# EAGLE design FM-1.2.1 (EAGLE 8.2.1)
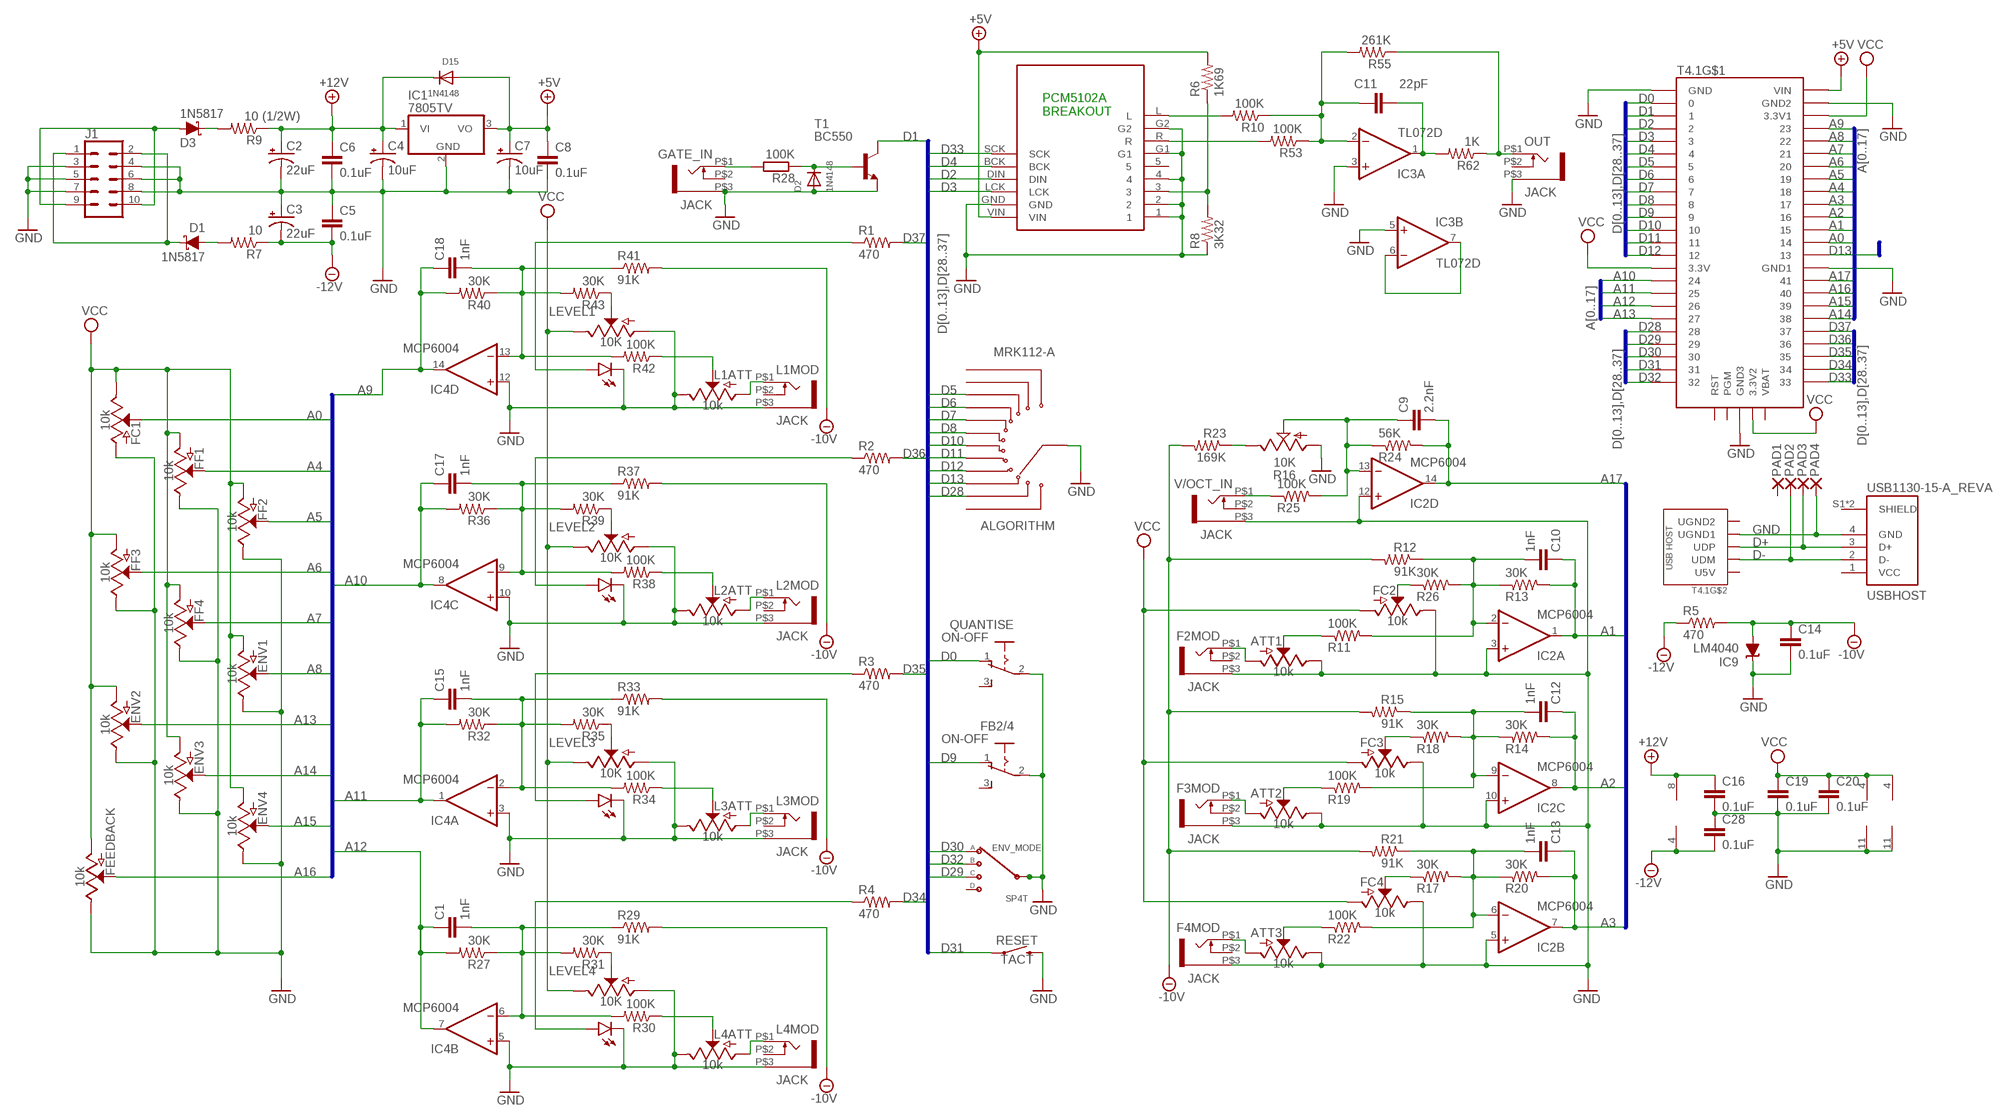
[diagram p0: schematic, sheet 1]

## Parts
ALGORITHM  MRK112-A  [SW_MRK112-A]
ATT1  10k  POTENTIOMETER-PTH-9MM-1/20W-20%  [POT-PTH-ALPS]
ATT2  10k  POTENTIOMETER-PTH-9MM-1/20W-20%  [POT-PTH-ALPS]
ATT3  10k  POTENTIOMETER-PTH-9MM-1/20W-20%  [POT-PTH-ALPS]
C1  1nF  C-EUC0603K  [C0603K]
C2  22uF  10UF-POLAR-RADIAL-2.5MM-25V-20%  [CPOL-RADIAL-2.5MM-5MM]
C3  22uF  10UF-POLAR-RADIAL-2.5MM-25V-20%  [CPOL-RADIAL-2.5MM-5MM]
C4  10uF  10UF-POLAR-RADIAL-2.5MM-25V-20%  [CPOL-RADIAL-2.5MM-5MM]
C5  0.1uF  C-EUC0603K  [C0603K]
C6  0.1uF  C-EUC0603K  [C0603K]
C7  10uF  10UF-POLAR-RADIAL-2.5MM-25V-20%  [CPOL-RADIAL-2.5MM-5MM]
C8  0.1uF  C-EUC0603K  [C0603K]
C9  2.2nF  C-EUC0603K  [C0603K]
C10  1nF  C-EUC0603K  [C0603K]
C11  22pF  C-EUC0603K  [C0603K]
C12  1nF  C-EUC0603K  [C0603K]
C13  1nF  C-EUC0603K  [C0603K]
C14  0.1uF  C-EUC0603K  [C0603K]
C15  1nF  C-EUC0603K  [C0603K]
C16  0.1uF  C-EUC0603K  [C0603K]
C17  1nF  C-EUC0603K  [C0603K]
C18  1nF  C-EUC0603K  [C0603K]
C19  0.1uF  C-EUC0603K  [C0603K]
C20  0.1uF  C-EUC0603K  [C0603K]
C28  0.1uF  C-EUC0603K  [C0603K]
D1  1N5817  DIODE-SCHOTTKY-BAT60A  [SOD-323]
D2  1N4148  DIODESOD-123  [SOD-123]
D3  1N5817  DIODE-SCHOTTKY-BAT60A  [SOD-323]
D15  1N4148  DIODESOD-123  [SOD-123]
ENV1  10k  POTENTIOMETER-PTH-9MM-1/20W-20%  [POT-PTH-ALPS]
ENV2  10k  POTENTIOMETER-PTH-9MM-1/20W-20%  [POT-PTH-ALPS]
ENV3  10k  POTENTIOMETER-PTH-9MM-1/20W-20%  [POT-PTH-ALPS]
ENV4  10k  POTENTIOMETER-PTH-9MM-1/20W-20%  [POT-PTH-ALPS]
ENV_MODE  SP4T  [SP4T]
F2MOD  JACK  WQP-PJ301M-12_JACK  [WQP-PJ301M-12_JACK]
F3MOD  JACK  WQP-PJ301M-12_JACK  [WQP-PJ301M-12_JACK]
F4MOD  JACK  WQP-PJ301M-12_JACK  [WQP-PJ301M-12_JACK]
FB2/4  ON-OFF  255SB  [255SB]
FC1  10k  POTENTIOMETER-PTH-9MM-1/20W-20%  [POT-PTH-ALPS]
FC2  10k  POTENTIOMETER-PTH-9MM-1/20W-20%  [POT-PTH-ALPS]
FC3  10k  POTENTIOMETER-PTH-9MM-1/20W-20%  [POT-PTH-ALPS]
FC4  10k  POTENTIOMETER-PTH-9MM-1/20W-20%  [POT-PTH-ALPS]
FEEDBACK  10k  POTENTIOMETER-PTH-9MM-1/20W-20%  [POT-PTH-ALPS]
FF1  10k  POTENTIOMETER-PTH-9MM-1/20W-20%  [POT-PTH-ALPS]
FF2  10k  POTENTIOMETER-PTH-9MM-1/20W-20%  [POT-PTH-ALPS]
FF3  10k  POTENTIOMETER-PTH-9MM-1/20W-20%  [POT-PTH-ALPS]
FF4  10k  POTENTIOMETER-PTH-9MM-1/20W-20%  [POT-PTH-ALPS]
GATE_IN  JACK  WQP-PJ301M-12_JACK  [WQP-PJ301M-12_JACK]
IC1  7805TV  [TO220V]
IC2  MCP6004  4AMP_P4+11D  [SO14]
IC3  TL072D  [SO08]
IC4  MCP6004  4AMP_P4+11D  [SO14]
IC9  LM4040  LM4041A12LP  [LP_O-PBCY-W3]
J1  CONN_05X2SHD  [2X5-SHROUDED]
L1ATT  10k  POTENTIOMETER-PTH-9MM-1/20W-20%  [POT-PTH-ALPS]
L1MOD  JACK  WQP-PJ301M-12_JACK  [WQP-PJ301M-12_JACK]
L2ATT  10k  POTENTIOMETER-PTH-9MM-1/20W-20%  [POT-PTH-ALPS]
L2MOD  JACK  WQP-PJ301M-12_JACK  [WQP-PJ301M-12_JACK]
L3ATT  10k  POTENTIOMETER-PTH-9MM-1/20W-20%  [POT-PTH-ALPS]
L3MOD  JACK  WQP-PJ301M-12_JACK  [WQP-PJ301M-12_JACK]
L4ATT  10k  POTENTIOMETER-PTH-9MM-1/20W-20%  [POT-PTH-ALPS]
L4MOD  JACK  WQP-PJ301M-12_JACK  [WQP-PJ301M-12_JACK]
LEVEL1  10K  POTENTIOMETER_SLIDE_LEDMEDIUM  [SLIDER-MEDIUM-LED]
LEVEL2  10K  POTENTIOMETER_SLIDE_LEDMEDIUM  [SLIDER-MEDIUM-LED]
LEVEL3  10K  POTENTIOMETER_SLIDE_LEDMEDIUM  [SLIDER-MEDIUM-LED]
LEVEL4  10K  POTENTIOMETER_SLIDE_LEDMEDIUM  [SLIDER-MEDIUM-LED]
OUT  JACK  WQP-PJ301M-12_JACK  [WQP-PJ301M-12_JACK]
PAD1  1,6/0,9  [1,6/0,9]
PAD2  1,6/0,9  [1,6/0,9]
PAD3  1,6/0,9  [1,6/0,9]
PAD4  1,6/0,9  [1,6/0,9]
QUANTISE  ON-OFF  255SB  [255SB]
R1  470  R-US_R0603  [R0603]
R2  470  R-US_R0603  [R0603]
R3  470  R-US_R0603  [R0603]
R4  470  R-US_R0603  [R0603]
R5  470  R-US_R0603  [R0603]
R6  1K69  R-US_R0603  [R0603]
R7  10  R-US_R0603  [R0603]
R8  3K32  R-US_R0603  [R0603]
R9  10 (1/2W)  R-US_0207/10  [0207/10]
R10  100K  R-US_R0603  [R0603]
R11  100K  R-US_R0603  [R0603]
R12  91K  R-US_R0603  [R0603]
R13  30K  R-US_R0603  [R0603]
R14  30K  R-US_R0603  [R0603]
R15  91K  R-US_R0603  [R0603]
R16  10K  TRIM_US-B25P  [B25P]
R17  30K  R-US_R0603  [R0603]
R18  30K  R-US_R0603  [R0603]
R19  100K  R-US_R0603  [R0603]
R20  30K  R-US_R0603  [R0603]
R21  91K  R-US_R0603  [R0603]
R22  100K  R-US_R0603  [R0603]
R23  169K  R-US_R0603  [R0603]
R24  56K  R-US_R0603  [R0603]
R25  100K  R-US_R0603  [R0603]
R26  30K  R-US_R0603  [R0603]
R27  30K  R-US_R0603  [R0603]
R28  100K  R-EU_R0603  [R0603]
R29  91K  R-US_R0603  [R0603]
R30  100K  R-US_R0603  [R0603]
R31  30K  R-US_R0603  [R0603]
R32  30K  R-US_R0603  [R0603]
R33  91K  R-US_R0603  [R0603]
R34  100K  R-US_R0603  [R0603]
R35  30K  R-US_R0603  [R0603]
R36  30K  R-US_R0603  [R0603]
R37  91K  R-US_R0603  [R0603]
R38  100K  R-US_R0603  [R0603]
R39  30K  R-US_R0603  [R0603]
R40  30K  R-US_R0603  [R0603]
R41  91K  R-US_R0603  [R0603]
R42  100K  R-US_R0603  [R0603]
R43  30K  R-US_R0603  [R0603]
R53  100K  R-US_R0603  [R0603]
R55  261K  R-US_R0603  [R0603]
R62  1K  R-US_R0603  [R0603]
RESET  TACT  MOMENTARY-SWITCH-SPST-PTH-6.0MM  [TACTILE_SWITCH_PTH_6.0MM]
T1  BC550  BC547  [TO92]
T4.1  TEENSY4.1  [TEENSY4.1]
U$2  PCM5102A BREAKOUT  I2S_PCM_51XX_SOUNDCARD  [I2S_PCM_5100_SOUNDCARD]
USBHOST  USB1130-15-A_REVA  [GCT_USB1130-15-A_REVA]
V/OCT_IN  JACK  WQP-PJ301M-12_JACK  [WQP-PJ301M-12_JACK]

## Nets
+5V: C7.1(+) C8.1 D15.A IC1.3(VO) R6.2 T4.1.VIN U$2.VIN
+12V: C2.1(+) C4.1(+) C6.1 C16.1 D15.C IC1.1(VI) IC3.8(P:V+) R9.1
-10V: C14.1 IC9.3(A) R5.2 R12.2 R15.2 R21.2 R23.2 R29.2 R33.2 R37.2 R41.2
-12V: C3.2(-) C5.2 C28.2 IC3.4(P:V-) R5.1 R7.1
A0: FC1.P$2(S) T4.1.14/A0
A1: C10.1 IC2.1(A:OUT) R13.2 T4.1.15/A1
A2: C12.1 IC2.8(C:OUT) R14.2 T4.1.16/A2
A3: C13.1 IC2.7(B:OUT) R20.2 T4.1.17/A3
A4: FF1.P$2(S) T4.1.18/A4/SDA
A5: FF2.P$2(S) T4.1.19/A5/SCL
A6: FF3.P$2(S) T4.1.20/A6
A7: FF4.P$2(S) T4.1.21/A7
A8: ENV1.P$2(S) T4.1.22/A8
A9: C18.1 IC4.14(D:OUT) R40.2 T4.1.23/A9
A10: C17.1 IC4.8(C:OUT) R36.2 T4.1.24
A11: C15.1 IC4.1(A:OUT) R32.2 T4.1.25
A12: C1.1 IC4.7(B:OUT) R27.2 T4.1.26
A13: ENV2.P$2(S) T4.1.27
A14: ENV3.P$2(S) T4.1.38
A15: ENV4.P$2(S) T4.1.39
A16: FEEDBACK.P$2(S) T4.1.40
A17: C9.2 IC2.14(D:OUT) R24.2 T4.1.41
D0: QUANTISE.1(O) T4.1.0/RX
D1: T1.3(C) T4.1.1/TX
D2: T4.1.2 U$2.DIN
D3: T4.1.3 U$2.LCK
D4: T4.1.4 U$2.BCK
D5: ALGORITHM.10 T4.1.5
D6: ALGORITHM.9 T4.1.6
D7: ALGORITHM.8 T4.1.7
D8: ALGORITHM.7 T4.1.8
D9: FB2/4.1(O) T4.1.9
D10: ALGORITHM.6 T4.1.10/CS
D11: ALGORITHM.5 T4.1.11/MOSI
D12: ALGORITHM.4 T4.1.12/MISO
D13: ALGORITHM.3 T4.1.13/SCK
D28: ALGORITHM.2 T4.1.28
D29: ENV_MODE.4(C) T4.1.29
D30: ENV_MODE.2(A) T4.1.30
D31: RESET.1 T4.1.31/A12
D32: ENV_MODE.3(B) T4.1.32
D33: T4.1.33 U$2.SCK
D34: R4.2 T4.1.34
D35: R3.2 T4.1.35
D36: R2.2 T4.1.36
D37: R1.2 T4.1.37
D+: PAD3.1(P) T4.1.UD+(UDP) USBHOST.3(D+)
D-: PAD2.1(P) T4.1.UD-(UDM) USBHOST.2(D-)
GND: ALGORITHM.A ATT1.P$1(E) ATT2.P$1(E) ATT3.P$1(E) C2.2(-) C3.1(+) C4.2(-) C5.1 C6.2 C7.2(-) C8.2 C14.2 C16.2 C19.2 C20.2 C28.1 D2.A ENV1.P$1(E) ENV2.P$1(E) ENV3.P$1(E) ENV4.P$1(E) ENV_MODE.1(INPUT) ENV_MODE.6 F2MOD.P$3 F3MOD.P$3 F4MOD.P$3 FB2/4.2(P) FC1.P$3(A) FC2.P$1(E) FC3.P$1(E) FC4.P$1(E) FEEDBACK.P$1(E) FF1.P$1(E) FF2.P$1(E) FF3.P$1(E) FF4.P$1(E) GATE_IN.P$3 IC1.2(GND) IC2.3(A:+IN) IC2.5(B:+IN) IC2.10(C:+IN) IC2.11(P:V-) IC2.12(D:+IN) IC3.3(A:+IN) IC3.5(B:+IN) IC4.3(A:+IN) IC4.5(B:+IN) IC4.10(C:+IN) IC4.11(P:V-) IC4.12(D:+IN) IC9.2(C) J1.3 J1.4 J1.5 J1.6 J1.7 J1.8 L1ATT.P$1(E) L1MOD.P$3 L2ATT.P$1(E) L2MOD.P$3 L3ATT.P$1(E) L3MOD.P$3 L4ATT.P$1(E) L4MOD.P$3 LEVEL1.P$1 LEVEL1.P$E(E) LEVEL2.P$1 LEVEL2.P$E(E) LEVEL3.P$1 LEVEL3.P$E(E) LEVEL4.P$1 LEVEL4.P$E(E) OUT.P$3 PAD4.1(P) QUANTISE.2(P) R8.1 R16.A RESET.3 T1.1(E) T4.1.AGND(GND2) T4.1.GND T4.1.GND1 T4.1.GND2(GND3) T4.1.GND-U1(UGND1) U$2.1 U$2.2 U$2.4 U$2.G1 U$2.G2 U$2.GND USBHOST.4(GND) V/OCT_IN.P$3
N$1: C11.2 IC3.1(A:OUT) R62.2
N$2: LEVEL3.P$B(B) R3.1
N$3: C15.2 IC4.2(A:-IN) R32.1 R33.1 R34.2 R35.2
N$4: D1.C J1.1 J1.2
N$5: R25.1 V/OCT_IN.P$1
N$6: D3.A J1.9 J1.10
N$7: D3.C R9.2
N$8: LEVEL3.P$2 R35.1
N$9: D1.A R7.2
N$10: LEVEL4.P$B(B) R4.1
N$11: R10.2 U$2.L
N$12: R6.1 R8.2 U$2.3
N$13: R53.2 U$2.R
N$14: ATT2.P$3(A) F3MOD.P$1
N$15: FC2.P$2(S) R26.1
N$16: C10.2 IC2.2(A:-IN) R11.2 R12.1 R13.1 R26.2
N$17: C12.2 IC2.9(C:-IN) R14.1 R15.1 R18.2 R19.2
N$18: ATT1.P$2(S) R11.1
N$19: C13.2 IC2.6(B:-IN) R17.2 R20.1 R21.1 R22.2
N$20: ATT2.P$2(S) R19.1
N$21: C9.1 IC2.13(D:-IN) R16.S R24.1 R25.2
N$22: FC4.P$2(S) R17.1
N$23: ATT3.P$3(A) F4MOD.P$1
N$24: FC3.P$2(S) R18.1
N$25: R16.E R23.1
N$26: IC3.6(B:-IN) IC3.7(B:OUT)
N$27: ATT3.P$2(S) R22.1
N$28: ATT1.P$3(A) F2MOD.P$1
N$29: GATE_IN.P$1 R28.2
N$30: D2.C R28.1 T1.2(B)
N$31: C1.2 IC4.6(B:-IN) R27.1 R29.1 R30.2 R31.2
N$32: LEVEL4.P$2 R31.1
N$33: L4ATT.P$3(A) L4MOD.P$1
N$34: L4ATT.P$2(S) R30.1
N$36: L3ATT.P$3(A) L3MOD.P$1
N$37: L3ATT.P$2(S) R34.1
N$39: LEVEL2.P$B(B) R2.1
N$40: C17.2 IC4.9(C:-IN) R36.1 R37.1 R38.2 R39.2
N$41: LEVEL2.P$2 R39.1
N$42: L2ATT.P$3(A) L2MOD.P$1
N$43: L2ATT.P$2(S) R38.1
N$45: LEVEL1.P$B(B) R1.1
N$46: C18.2 IC4.13(D:-IN) R40.1 R41.1 R42.2 R43.2
N$47: LEVEL1.P$2 R43.1
N$48: L1ATT.P$3(A) L1MOD.P$1
N$49: L1ATT.P$2(S) R42.1
N$53: C11.1 IC3.2(A:-IN) R10.1 R53.1 R55.2
N$55: OUT.P$1 R55.1 R62.1
VCC: C19.1 C20.1 ENV1.P$3(A) ENV2.P$3(A) ENV3.P$3(A) ENV4.P$3(A) FC1.P$1(E) FC2.P$3(A) FC3.P$3(A) FC4.P$3(A) FEEDBACK.P$3(A) FF1.P$3(A) FF2.P$3(A) FF3.P$3(A) FF4.P$3(A) IC2.4(P:V+) IC4.4(P:V+) LEVEL1.P$3 LEVEL2.P$3 LEVEL3.P$3 LEVEL4.P$3 T4.1.3V3(3.3V) T4.1.3V3_LO(3.3V1) T4.1.V33(3.3V2)
Unconnected: ALGORITHM.1 ALGORITHM.11 ALGORITHM.12 ENV_MODE.5(D) F2MOD.P$2 F3MOD.P$2 F4MOD.P$2 FB2/4.3(S) GATE_IN.P$2 L1MOD.P$2 L2MOD.P$2 L3MOD.P$2 L4MOD.P$2 OUT.P$2 PAD1.1(P) QUANTISE.3(S) T4.1.ELED T4.1.ER+ T4.1.ER- T4.1.ET+(ET-) T4.1.ET-(ET+) T4.1.GND-E(EGND) T4.1.GND-U2(UGND2) T4.1.PROG(PGM) T4.1.RST T4.1.UVHST(U5V) T4.1.VBAT U$2.5 USBHOST.S1(SHIELD) USBHOST.S2(SHIELD) V/OCT_IN.P$2

## Buses
A[0..17]
D[0..13],D[28..37]

## Notes on the sheet
- PCM5102A
  BREAKOUT

## Power pins joined to a net without a drawn wire
VCC: USBHOST.1(VCC)

## Library data of the parts
ALGORITHM = MRK112-A:MRK112-A: Check availability <https://pricing.snapeda.com/parts/MRK112-A/NKK%20Switches/view-part?ref=eda>; AVAILABILITY: In Stock; DESCRIPTION: Rotary Switch 2 ~ 12 Position SP12T 0.4VA (AC/DC) 28 VAC Panel Mount, Through Hole; MF: NKK Switches; MP: MRK112-A; PACKAGE: None; PRICE: None; PURCHASE-URL: https://pricing.snapeda.com/search/part/MRK112-A/?ref=eda
ATT1-ATT3 ENV1-ENV4 FC1-FC4 FEEDBACK FF1-FF4 L1ATT L2ATT L3ATT L4ATT = SparkFun-Resistors:POTENTIOMETER: Potentiometer (Pot) Three-terminal potentiometers, with an adjustable wiper and two adjustable resistors. A pot can be used to create a configurable voltage divider, or as a variable resistor. Variants ALPS_POT and ALPS_POT_KIT - PTH, breadboard compatible, 9mm square pots Rotary Potentiometer - Linear (10k ohm) <https://www.sparkfun.com/products/9288> (COM-09288) The KIT variant exposes copper on only one side of the PTH pad, so the part can only be assembled on one side of the PCB. Useful for beginner soldering kits.; PROD_ID: RES-09177; SF_SKU: COM-09288
C1 C5 C6 C8-C20 C28 = rcl:C-EU: CAPACITOR, European symbol
C2 C3 = SparkFun-Capacitors:10UF-POLAR: 10.0µF polarized capacitors A capacitor is a passive two-terminal electrical component used to store electrical energy temporarily in an electric field.; PROD_ID: CAP-08440; VALUE: 10uF
C4 C7 = SparkFun-Capacitors:10UF-POLAR: 10.0µF polarized capacitors A capacitor is a passive two-terminal electrical component used to store electrical energy temporarily in an electric field.; PROD_ID: CAP-08440
D1 D3 = SparkFun-DiscreteSemi:DIODE-SCHOTTKY: Schottky diode A Schottky diode is a semiconductor diode which has a low forward voltage drop and a very fast switching action.; PROD_ID: DIO-14072; VALUE: 3A/10V/280mV
D2 D15 = adafruit:DIODE: Diode SMADIODE - SMA Surface Mount Package 20V 1A Schottky Diode Digikey: 641-1014-6-ND DO-1N4148 - Through Hole Small Current Diode SOD-123 20V 1 A (.5mV Vf) Schottky Diode - Digikey: MBRX120TPMSCT-ND SOD-323 10V 570mA (.38mV Vf, 3ns) Schottky Diode - Digikey: ZLLS410CT-ND SOD-523 30V 30mA Schottky Diode (RB751S-40TE61) - Digikey: RB751S-40TE61CT-ND SOT23-R/W - SOT23 Package (R = Solder Paste/Reflow Ovens, W = Hand-Soldering) BAT54Film 40V 300mA - Digikey: 497-7162-1-ND
ENV_MODE = switches-2:SP4T
F2MOD F3MOD F4MOD GATE_IN L1MOD L2MOD L3MOD L4MOD OUT V/OCT_IN = thonkiconn:WQP-PJ301M-12_JACK
FB2/4 QUANTISE = customswitch:255SB: SLIDING SWITCH Distributor Buerklin, 11G810
IC1 = linear:78*: Positive VOLTAGE REGULATOR Source: http://cache.national.com/ds/LM/LM78L05.pdf http://www.fairchildsemi.com/ds/LM/LM7805.pdf
IC2 IC4 = linear:4AMP_P4+11: OP AMP
IC3 = linear:TL072: OP AMP
IC9 = texas:LM4041: PRECISION MICROPOWER SHUNT VOLTAGE REFERENCE Source: http://focus.ti.com/lit/ds/slcs146e/slcs146e.pdf; OC_FARNELL: 9486119; OC_NEWARK: unknown
J1 = SparkFun-Connectors:CONN_05X2: Multi connection point. Often used as Generic Header-pin footprint for 0.1 inch spaced/style header connections For AVR SPI programming port, see special device with nice symbol: "AVR_SPI_PROG_5x2.dev" You can populate with any combo of single row headers, but if you'd like an exact match, check these: 2x5 AVR ICSP Male Header <https://www.sparkfun.com/products/778> (PRT-00778) 2x5 Pin Shrouded Header <https://www.sparkfun.com/products/8506> (PRT-08506) On any of the 0.1 inch spaced packages, you can populate with these: Break Away Headers - Straight <https://www.sparkfun.com/products/116> (PRT-00116) Break Away Male Headers - Right Angle <https://www.sparkfun.com/products/553> (PRT-00553) Female Headers <https://www.sparkfun.com/products/115> (PRT-00115) Break Away Headers - Machine Pin <https://www.sparkfun.com/products/117> (PRT-00117) Break Away Female Headers - Swiss Machine Pin <https://www.sparkfun.com/products/743> (PRT-00743) Special note: the shrouded connector mates well with our 5x2 ribbon cables: 2x5 Pin IDC Ribbon Cable <https://www.sparkfun.com/products/8535> (PRT-08535); PROD_ID: CONN-08671; SF_ID: PRT-08506
LEVEL1-LEVEL4 = SparkFun-Resistors:POTENTIOMETER_SLIDE_LED: Slide Potentiometer Slide-type potentiometers - pots that are adjusted by sliding a wiper up or down. Commonly found en-masse on sound boards. Variants 60MM - Slide Pot - X-Large (10k Linear Taper) <https://www.sparkfun.com/products/9119> (COM-09119) 10k linear slide pot with 60mm travel. Datasheet <http://cdn.sparkfun.com/datasheets/Components/Switches/SC608N-b10k.pdf> 30MM, 30MM-KIT - Slide Pot - Medium (10k Linear Taper) <https://www.sparkfun.com/products/11621> (COM-11621) 10k linear slide pot with 30mm travel. Datasheet <http://cdn.sparkfun.com/datasheets/Components/Switches/C-31-.pdf> (C3031N-1A2-B10K-GP) "KIT" variant, intended for soldering kits, has tStop removed from pads so the component can only be stuffed on one side of the board. 20MM - Slide Pot - Small (10k Linear Taper) <https://www.sparkfun.com/products/11620> (COM-11620) 10k linear slide pot with 20mm travel. Datasheet <http://cdn.sparkfun.com/datasheets/Components/Switches/C-31-.pdf> (C2031N-1A2-B10K-GP)
PAD1-PAD4 = wirepad:1,6/0,9: THROUGH-HOLE PAD
R1-R15 R17-R27 R29-R43 R53 R55 R62 = rcl:R-US_: RESISTOR, American symbol
R16 = pot:TRIM_US-: POTENTIOMETER
R28 = resistor:R-EU_: RESISTOR, European symbol
RESET = SparkFun-Switches:MOMENTARY-SWITCH-SPST: Momentary Switch (Pushbutton) - SPST Normally-open (NO) SPST momentary switches (buttons, pushbuttons). Variants PTH-12MM - 12mm square, through-hole Momentary Pushbutton Switch - 12mm Square <https://www.sparkfun.com/products/9190> (COM-09190) PTH-6.0MM, PTH-6.0MM-KIT - 6.0mm square, through-hole Mini Pushbutton Switch <https://www.sparkfun.com/products/97> (COM-00097) KIT package intended for soldering kit's - only one side of pads' copper is exposed. PTH-RIGHT-ANGLE-KIT - Right-angle, through-hole Right Angle Tactile Button <https://www.sparkfun.com/products/10791> - Used on SparkFun BigTime Watch Kit <https://www.sparkfun.com/products/11734> SMD-12MM - 12mm square, surface-mount Tactile Button - SMD (12mm) <https://www.sparkfun.com/products/12993> (COM-12993) Used on SparkFun PicoBoard <https://www.sparkfun.com/products/11888> SMD-4.5MM - 4.5mm Square Trackball Switch Used on SparkFun Blackberry Trackballer Breakout <https://www.sparkfun.com/products/13169> SMD-4.6MMX2.8MM - 4.60mm x 2.80mm, surface mount Used on SparkFun Pro Micro - RP2040 <https://www.sparkfun.com/products/17717> SMD-5.2MM, SMD-5.2-REDUNDANT - 5.2mm square, surface-mount Mini Pushbutton Switch - SMD <https://www.sparkfun.com/products/8720> (COM-08720) Used on Arduino Pro Mini <https://www.sparkfun.com/products/11114> REDUNDANT package connects both switch circuits together SMD-6.0X3.5MM - 6.0 x 3.5mm, surface mount Momentary Reset Switch SMD <https://www.sparkfun.com/products/8229> (COM-08229) SMD-6.2MM-TALL - 6.2mm square, surface mount Tactile Button - SMD (6mm) <https://www.sparkfun.com/products/12992> Used on SparkFun Digital Sandbox <https://www.sparkfun.com/products/12651> SMD-RIGHT-ANGLE - Right-angle, surface mount Used on SparkFun Block for Intel® Edison - Arduino <https://www.sparkfun.com/products/13036>; PROD_ID: SWCH-08441; SF_SKU: COM-00097
T1 = transistor:BC547: NPN TRANSISTOR
T4.1 = teensy4.1.dist:TEENSY4.1
U$2 = PCM5102A:I2S_PCM_51XX_SOUNDCARD
USBHOST = USB1130-15-A_REVA:USB1130-15-A_REVA: Check availability <https://pricing.snapeda.com/parts/USB1130-15-A/Global%20Connector%20Technology/view-part?ref=eda>; AVAILABILITY: In Stock; DESCRIPTION: USB 2.0 Connector Full size Horizontal Plug, type A, 4 Pins, Through hole, Top mount, 6.99mm profile, High mating cycle, charging receptacle; MF: Global Connector Technology; MP: USB1130-15-A; PACKAGE: None; PRICE: None; PURCHASE-URL: https://pricing.snapeda.com/search/part/USB1130-15-A/?ref=eda

## Board
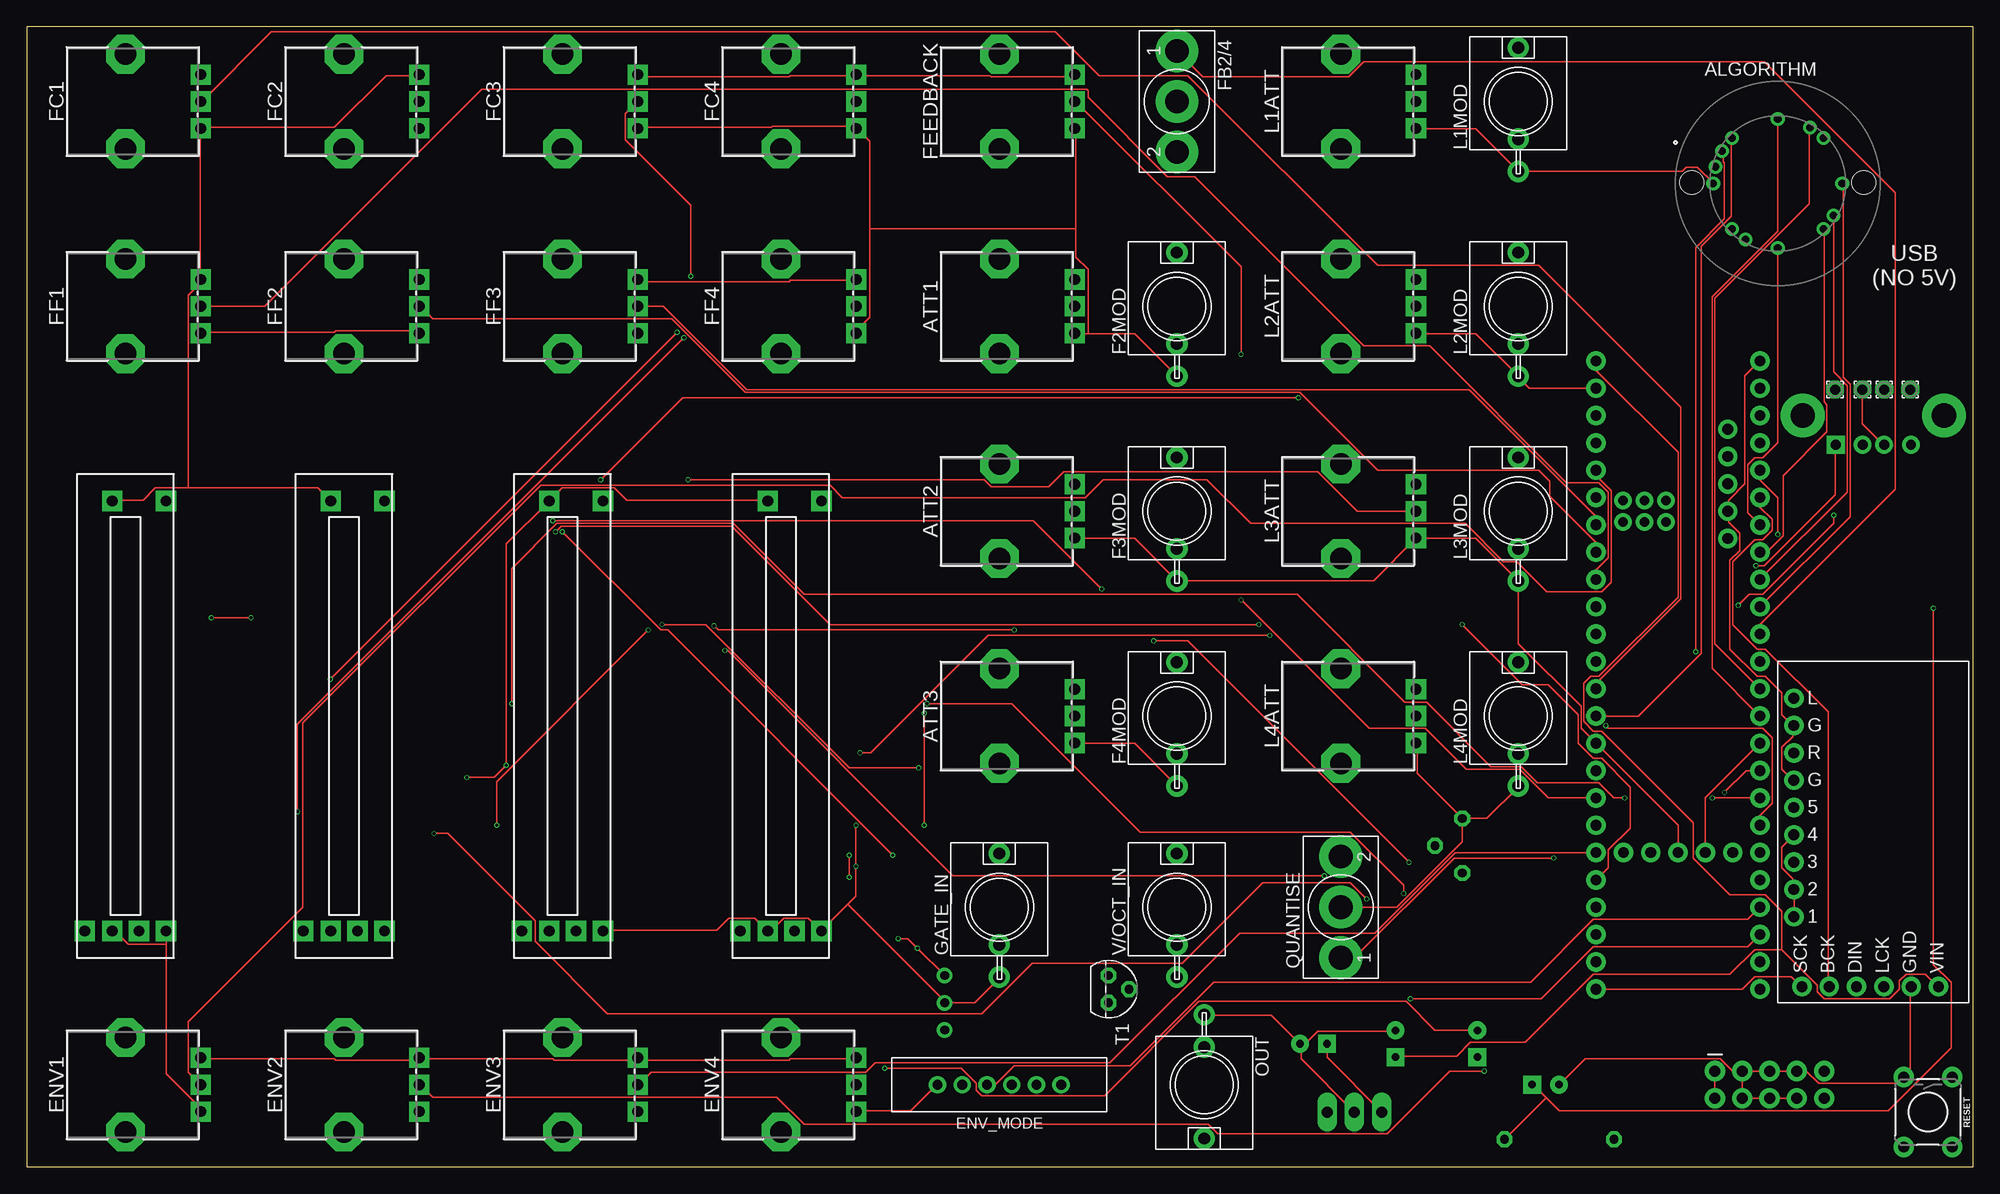
[diagram p1: board, top side]
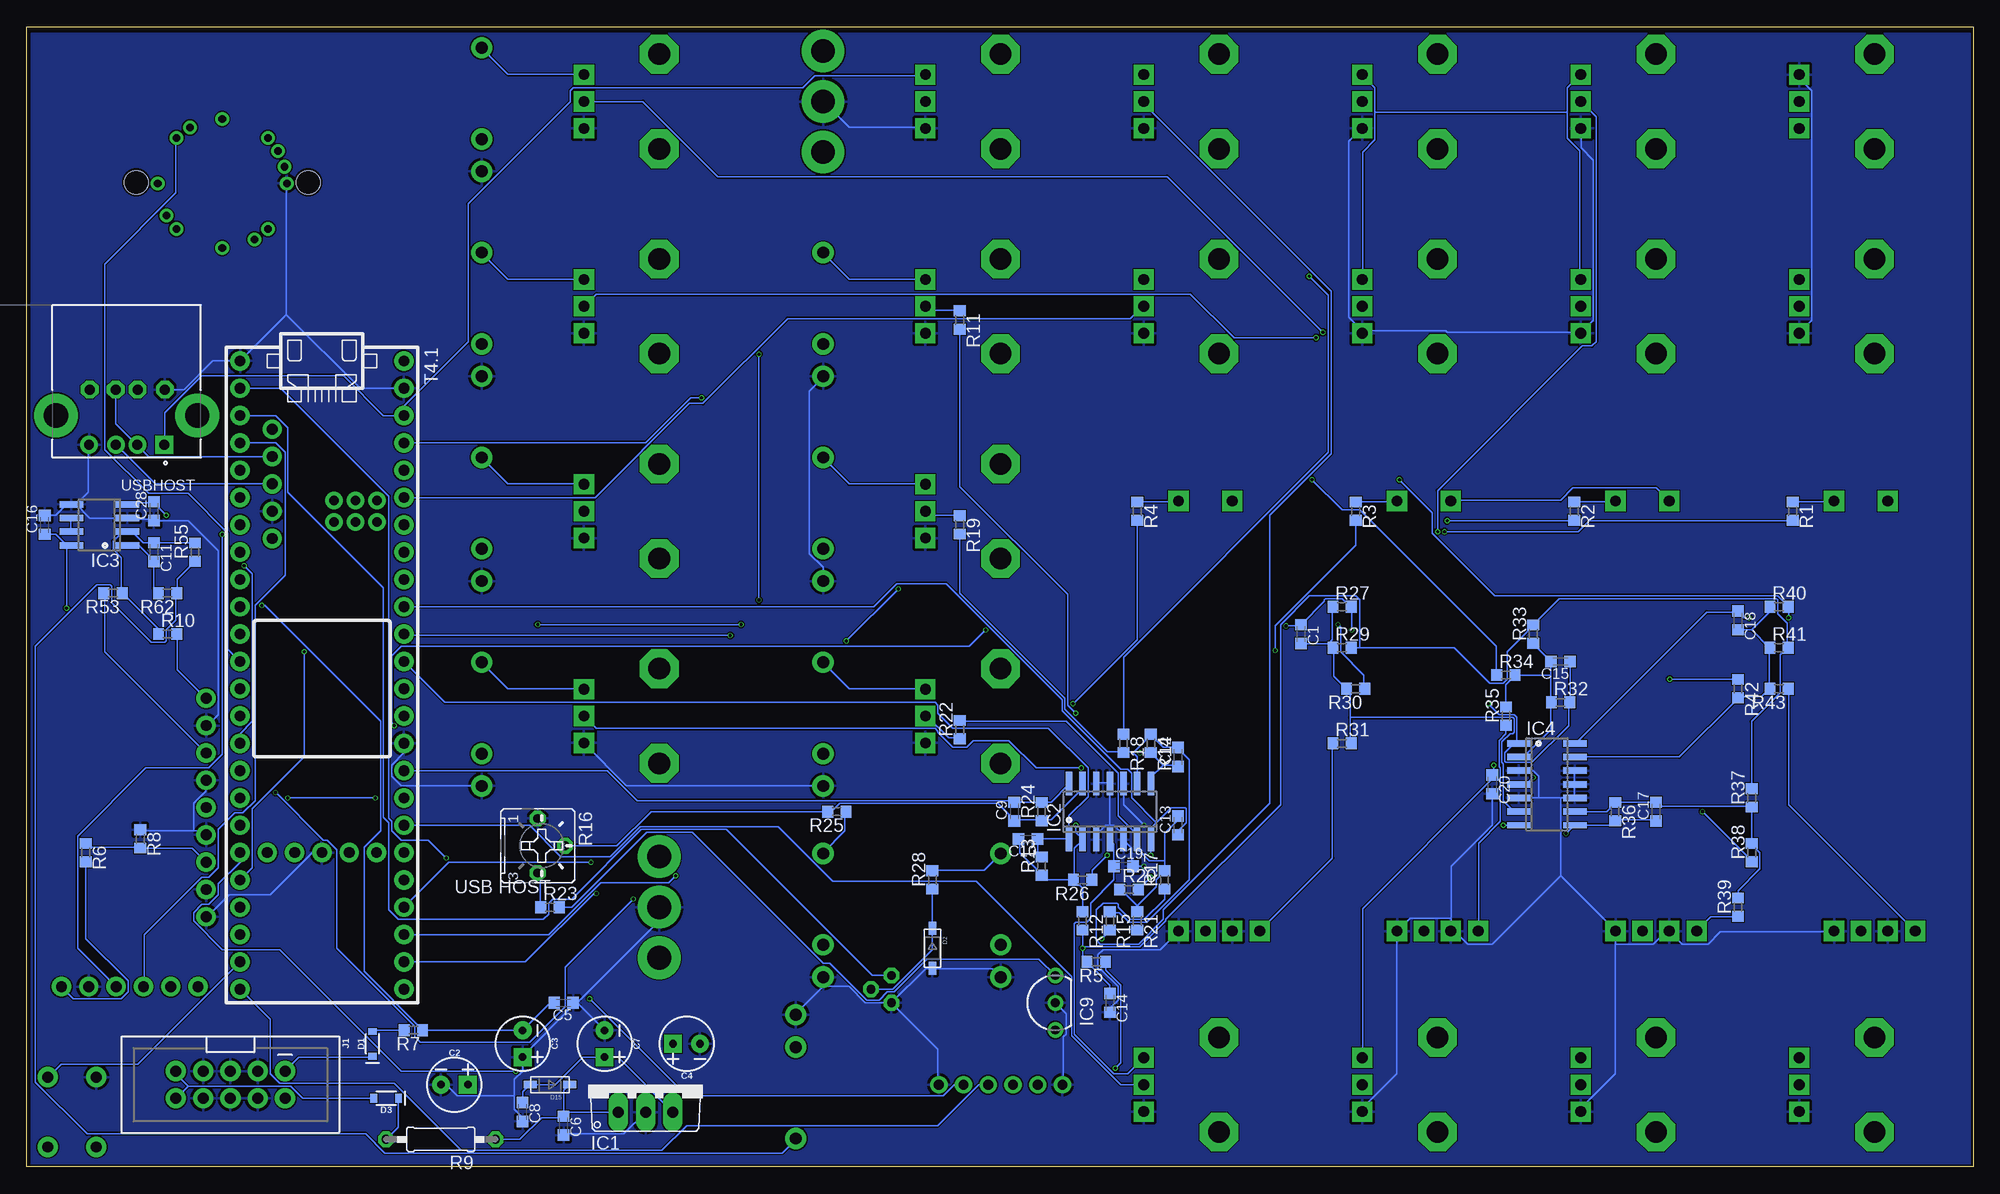
[diagram p2: board, bottom side, seen from below]

Size 181 x 106 mm. Coordinates in mm from the lower left corner, seen from the top.
Outline: 0,0 181,0 181,106 0,106 0,0
Copper layers (1*16): Top 0.035mm / dielectric 1.6mm / Bottom 0.035mm
Design rules "jlcpcb-2layers": minimum track width 5mil, minimum drill 0.3mm, track to track 5mil, track to pad 5mil, pad to pad 5mil, via to via 5mil, smd to smd 5mil, copper to edge 0.2mm, drill to drill 6mil, minimum pad ring 10mil, minimum via ring 3mil, stop-mask expansion 4mil, vias tented up to drill 0mil, thermal gap 10mil
Holes 2.2 mm at 154.83,91.53 170.83,91.53

### Footprints (pad centres in the part's own frame; a part is rotated, then mirrored left to right if it is on the bottom)
SW_MRK112-A = drill 0.7 pad 1: 1 -1.553,-5.796; 2 -3,-5.196; 3 -4.243,-4.243; 4 -6,0; 5 -5.196,3; 6 -4.243,4.243; 7 0,6; 8 3,5.196; 9 4.243,4.243; 10 6,0; 11 5.196,-3; 12 4.243,-4.243; A 0,-6
POT-PTH-ALPS = drill 1 pad 1.88 square: P$1 7,-2.5; P$2 7,0; P$3 7,2.5 | drill 2 octagon: P$4 0,-4.4; P$5 0,4.4
C0603K = smd 1.05 x 1.08: 1 -0.875,0; 2 0.875,0
CPOL-RADIAL-2.5MM-5MM = drill 0.7 pad 1.651 square: 1 1.25,0 | drill 0.7 pad 1.651: 2 -1.25,0
SOD-323 = smd 0.63 x 0.83: A 1.15,0; C -1.15,0
SOD-123 = smd 1.2 x 0.7: A 1.85,0; C -1.85,0
SP4T = drill 0.9: 1 -5.75,0; 2 -3.45,0; 3 -1.15,0; 4 1.15,0; 5 3.45,0; 6 5.75,0
WQP-PJ301M-12_JACK = drill 1.1: P$1 0,5; P$2 0,-3.5; P$3 0,-6.5
255SB = drill 2.2: 1 -4.7,0; 2 0,0; 3 4.7,0
TO220V = drill 1.016 long: 1 -2.54,-2.54; 2 0,-2.54; 3 2.54,-2.54
SO14 = smd 0.6 x 2.2: 1 -3.81,-2.6; 2 -2.54,-2.6; 3 -1.27,-2.6; 4 0,-2.6; 5 1.27,-2.6; 6 2.54,-2.6; 7 3.81,-2.6; 8 3.81,2.6; 9 2.54,2.6; 10 1.27,2.6; 11 0,2.6; 12 -1.27,2.6; 13 -2.54,2.6; 14 -3.81,2.6
SO08 = smd 0.6 x 2.2: 1 -1.905,-2.6; 2 -0.635,-2.6; 3 0.635,-2.6; 4 1.905,-2.6; 5 1.905,2.6; 6 0.635,2.6; 7 -0.635,2.6; 8 -1.905,2.6
LP_O-PBCY-W3 = drill 0.8 pad 1.4: 1 -2.54,0; 2 0,0; 3 2.54,0
2X5-SHROUDED = drill 1.016 pad 1.88: 1 -1.27,5.08; 2 1.27,5.08; 3 -1.27,2.54; 4 1.27,2.54; 5 -1.27,0; 6 1.27,0; 7 -1.27,-2.54; 8 1.27,-2.54; 9 -1.27,-5.08; 10 1.27,-5.08
SLIDER-MEDIUM-LED = drill 1 pad 1.88 square: P$1 -20,1.23; P$2 -20,3.77; P$3 20,1.23; P$B 20,-3.77; P$E -20,-3.77; P$L -20,-1.27
1,6/0,9 = drill 0.914 pad 1.6 octagon: 1 0,0
R0603 = smd 1 x 1.1: 1 -0.85,0; 2 0.85,0
0207/10 = drill 0.813 octagon: 1 -5.08,0; 2 5.08,0
B25P = drill 0.813 octagon: A -2.54,0; E 2.54,0; S 0,2.54
TACTILE_SWITCH_PTH_6.0MM = drill 1.016 pad 1.88: 1 -3.251,2.261; 2 3.251,2.261; 3 -3.251,-2.261; 4 3.251,-2.261
TO92 = drill 0.813 octagon: 1 1.27,0; 2 0,1.905; 3 -1.27,0
TEENSY4.1 = drill 1: 0/RX -26.67,-7.62; 1/TX -24.13,-7.62; 2 -21.59,-7.62; 3 -19.05,-7.62; 3V3 6.35,-7.62; 3V3_LO -24.13,7.62; 4 -16.51,-7.62; 5 -13.97,-7.62; 6 -11.43,-7.62; 7 -8.89,-7.62; 8 -6.35,-7.62; 9 -3.81,-7.62; 10/CS -1.27,-7.62; 11/MOSI 1.27,-7.62; 12/MISO 3.81,-7.62; 13/SCK 3.81,7.62; 14/A0 1.27,7.62; 15/A1 -1.27,7.62; 16/A2 -3.81,7.62; 17/A3 -6.35,7.62; 18/A4/SDA -8.89,7.62; 19/A5/SCL -11.43,7.62; 20/A6 -13.97,7.62; 21/A7 -16.51,7.62; 22/A8 -19.05,7.62; 23/A9 -21.59,7.62; 24 8.89,-7.62; 25 11.43,-7.62; 26 13.97,-7.62; 27 16.51,-7.62; 28 19.05,-7.62; 29 21.59,-7.62; 30 24.13,-7.62; 31/A12 26.67,-7.62; 32 29.21,-7.62; 33 29.21,7.62; 34 26.67,7.62; 35 24.13,7.62; 36 21.59,7.62; 37 19.05,7.62; 38 16.51,7.62; 39 13.97,7.62; 40 11.43,7.62; 41 8.89,7.62; AGND -26.67,7.62; GND -29.21,-7.62; GND1 6.35,7.62; GND2 16.51,0; GND-U1 -15.24,-4.62; GND-U2 -12.7,-4.62; PROG 16.51,2.54; RST 16.51,5.08; UD+ -17.78,-4.62; UD- -20.32,-4.62; UVHST -22.86,-4.62; V33 16.51,-2.54; VBAT 16.51,-5.08; VIN -29.21,7.62 | drill 0.9: ELED -16.24,3.12; ER+ -16.24,5.12; ER- -14.24,5.12; ET+ -14.24,1.12; ET- -16.24,1.12; GND-E -14.24,3.12
I2S_PCM_5100_SOUNDCARD = drill 1 pad 1.676: 1 1.5,8; 2 1.5,10.54; 3 1.5,13.08; 4 1.5,15.62; 5 1.5,18.16; BCK 4.79,1.5; DIN 7.33,1.5; G1 1.5,20.7; G2 1.5,25.78; GND 12.41,1.5; L 1.5,28.32; LCK 9.87,1.5; R 1.5,23.24; SCK 2.25,1.5; VIN 14.95,1.5
GCT_USB1130-15-A_REVA = drill 0.92 square: 1 -3.5,2.71 | drill 0.92: 2 -1,2.71; 3 1,2.71; 4 3.5,2.71 | drill 2.26: S1 -6.57,0; S2 6.57,0

### Placement (x,y rotation side)
ALGORITHM  162.83,91.44 270 top
ATT1  90.44,80.01 0 top
ATT2  90.44,60.96 0 top
ATT3  90.44,41.91 0 top
C1  62.5,49.53 270 bottom
C2  141.24,7.62 0 bottom
C3  134.89,11.43 270 bottom
C4  119.65,11.43 180 bottom
C5  131.08,15.24 180 bottom
C6  131.08,3.81 270 bottom
C7  127.27,11.43 270 bottom
C8  134.89,5.08 270 bottom
C9  89.17,33.02 90 bottom
C10  87.9,30.48 180 bottom
C11  169.18,57.15 270 bottom
C12  73.93,38.1 90 bottom
C13  73.93,31.75 90 bottom
C14  80.28,15.24 270 bottom
C15  38.37,46.99 180 bottom
C16  179.34,59.69 90 bottom
C17  29.48,33.02 90 bottom
C18  21.86,50.8 270 bottom
C19  79.01,27.94 0 bottom
C20  44.72,35.56 270 bottom
C28  169.18,60.96 90 bottom
D1  148.86,11.43 90 bottom
D2  96.79,20.32 270 bottom
D3  147.59,6.35 180 bottom
D15  132.35,7.62 180 bottom
ENV1  9.16,7.62 0 top
ENV2  29.48,7.62 0 top
ENV3  49.8,7.62 0 top
ENV4  70.12,7.62 0 top
ENV_MODE  90.44,7.62 180 top
F2MOD  106.95,80.01 0 top
F3MOD  106.95,60.96 0 top
F4MOD  106.95,41.91 0 top
FB2/4  106.95,99.06 270 top
FC1  9.16,99.06 0 top
FC2  29.48,99.06 0 top
FC3  49.8,99.06 0 top
FC4  70.12,99.06 0 top
FEEDBACK  90.44,99.06 0 top
FF1  9.16,80.01 0 top
FF2  29.48,80.01 0 top
FF3  49.8,80.01 0 top
FF4  70.12,80.01 0 top
GATE_IN  90.44,24.13 0 top
IC1  123.46,7.62 0 bottom
IC2  80.28,33.02 0 bottom
IC3  174.26,59.69 90 bottom
IC4  39.64,35.56 270 bottom
IC9  85.36,15.24 90 bottom
J1  162.07,7.62 270 bottom
L1ATT  122.19,99.06 0 top
L1MOD  138.7,99.06 0 top
L2ATT  122.19,80.01 0 top
L2MOD  138.7,80.01 0 top
L3ATT  122.19,60.96 0 top
L3MOD  138.7,60.96 0 top
L4ATT  122.19,41.91 0 top
L4MOD  138.7,41.91 0 top
LEVEL1  9.16,41.91 90 top
LEVEL2  29.48,41.91 90 top
LEVEL3  49.8,41.91 90 top
LEVEL4  70.12,41.91 90 top
OUT  109.49,7.62 180 top
PAD1  175.15,72.26 0 top
PAD2  172.74,72.26 0 top
PAD3  170.7,72.26 0 top
PAD4  168.16,72.26 0 top
QUANTISE  122.19,24.13 90 top
R1  16.78,60.96 270 bottom
R2  37.1,60.96 270 bottom
R3  57.42,60.96 270 bottom
R4  77.74,60.96 270 bottom
R5  81.55,19.05 180 bottom
R6  175.53,29.21 270 bottom
R7  145.05,12.7 180 bottom
R8  170.45,30.48 270 bottom
R9  142.51,2.54 180 bottom
R10  167.91,49.53 0 bottom
R11  94.25,78.74 270 bottom
R12  82.82,22.86 270 bottom
R13  86.63,27.94 90 bottom
R14  76.47,39.37 270 bottom
R15  80.28,22.86 270 bottom
R16  133.49,29.84 270 bottom
R17  75.2,26.67 90 bottom
R18  79.01,39.37 270 bottom
R19  94.25,59.69 270 bottom
R20  78.5,25.78 0 bottom
R21  77.74,22.86 270 bottom
R22  94.25,40.64 90 bottom
R23  132.35,24.13 0 bottom
R24  86.63,33.02 90 bottom
R25  105.68,33.02 180 bottom
R26  82.82,26.67 180 bottom
R27  58.69,52.07 0 bottom
R28  96.79,26.67 90 bottom
R29  58.69,48.26 0 bottom
R30  57.42,44.45 180 bottom
R31  58.69,39.37 0 bottom
R32  38.37,43.18 0 bottom
R33  40.91,49.53 90 bottom
R34  43.45,45.72 0 bottom
R35  43.45,41.91 90 bottom
R36  33.29,33.02 270 bottom
R37  20.59,34.29 90 bottom
R38  20.59,29.21 90 bottom
R39  21.86,24.13 90 bottom
R40  18.05,52.07 0 bottom
R41  18.05,48.26 0 bottom
R42  21.86,44.45 270 bottom
R43  18.05,44.45 180 bottom
R53  172.99,53.34 180 bottom
R55  165.37,57.15 90 bottom
R62  167.91,53.34 180 bottom
RESET  176.8,5.08 270 top
T1  100.6,16.51 270 top
T4.1  153.56,45.72 270 bottom
U$2  162.83,15.24 0 top
USBHOST  171.72,69.85 180 bottom
V/OCT_IN  106.95,24.13 0 top

### Tracks (layer width: path | path; a pad name or v marks a point on that pad's centre or on a via)
+5V
  Top 0.127: T4.1.VIN 145.94,74.04 153.56,66.42 153.56,52.96 146.19,45.59 145.43,45.59 144.8,44.96 144.8,41.4 145.69,40.51 146.45,40.51 154.96,32 154.96,28.7 158.38,25.27 161.69,25.27 163.21,23.75 163.21,20.19 | 163.21,20.19 166.51,16.89 166.51,16.26 167.15,15.62 173.24,15.62 174.13,16.51 174.13,17.27 174.77,17.91 176.55,17.91 177.69,16.76 U$2.VIN | 163.21,20.19 160.67,20.19 158.38,17.91 145.69,17.91 139.34,11.56 134.25,11.56 132.99,10.29 127.27,10.29 C7.1
  Bottom 0.127: C8.1 134.89,6.99 134.25,7.62 D15.A 131.84,7.62 129.3,10.16 127.27,10.16 | IC1.3 126,10.16 127.27,10.16 | 127.27,10.16 C7.1 | R6.2 175.53,21.21 171.59,17.27 171.59,16.26 172.23,15.62 176.67,15.62 177.69,16.64 U$2.VIN
+12V  (via drill 0.3)
  Top 0.127: IC1.1 120.92,10.16 120.92,11.43 C4.1 | v177.31,51.94 177.31,18.8 178.96,17.14 178.96,11.05 173.12,5.21 142.51,5.21 141.24,6.48 | 141.24,6.48 140.1,7.62 C2.1 | R9.1 141.24,6.35 141.24,6.48
  Bottom 0.127: 131.08,5.08 131.08,7.11 130.57,7.62 D15.C | IC1.1 131.08,5.08 | 131.08,5.08 C6.1 131.08,4.57 133.11,4.57 135.14,2.54 R9.1 | 177.31,57.78 178.32,58.8 C16.1 | 177.31,57.78 IC3.8 176.93,57.78 | v177.31,51.94 177.31,57.78
-10V  (via drill 0.3)
  Top 0.127: v81.04,21.21 81.93,21.21 v82.82,20.32 IC9.3
  Bottom 0.127: R37.2 20.59,41.4 17.92,44.07 17.92,47.62 17.29,48.26 | 57.04,48.26 48.28,48.26 44.97,44.96 43.7,44.96 43.32,45.34 43.32,47.88 40.91,50.29 R33.2 40.91,50.42 38.5,52.83 18.3,52.83 18.18,52.7 18.18,51.44 17.29,50.55 17.29,48.26 | 57.04,48.26 R29.2 | 17.29,48.26 R41.2 | C14.1 80.28,16.89 82.44,19.05 | 82.82,20.45 R12.2 | 82.44,19.05 82.82,19.43 v82.82,20.32 82.82,20.45 | 82.44,19.05 R5.2 | R21.2 77.74,22.1 80.28,22.1 R15.2 80.28,21.97 v81.04,21.21 | R23.2 130.32,24.13 123.33,31.11 119.14,31.11 106.95,18.92 106.31,18.92 102.89,15.49 101.74,15.49 100.98,16.26 100.35,16.26 97.3,19.3 86.88,19.3 IC9.3 | 57.04,48.26 57.04,52.7 57.42,53.09 61.74,53.09 64.41,50.42 64.41,33.66 75.07,22.99 75.07,22.86 77.49,20.45 82.82,20.45
-12V  (via drill 0.3)
  Top 0.127: v79.77,9.14 86.88,9.14 88.28,7.75 88.28,7.11 88.79,6.6 100.22,6.6 108.98,15.37 128.29,15.37 130.95,12.7 134.89,12.7 C3.2 | v168.04,60.58 168.04,59.82 161.43,53.21 160.16,53.21 v159.15,52.2
  Bottom 0.127: 169.18,61.72 171.47,61.72 171.59,61.59 IC3.4 | C5.2 132.35,15.24 134.89,12.7 | v79.77,9.14 79.26,9.65 79.26,16.89 80.66,18.29 80.66,19.05 R5.1 | 134.89,12.7 144.16,12.7 | 134.89,12.7 C3.2 | v168.04,60.58 169.18,61.72 | v159.15,52.2 158.89,52.2 148.1,41.4 148.1,31.24 149.62,29.72 149.62,18.16 144.16,12.7 | 169.18,61.72 C28.2 | 144.16,12.7 R7.1
A0
  Top 0.127: T4.1.14/A0 145.94,44.96 153.81,52.83 153.81,70.61 140.6,83.82 125.62,83.82 107.97,101.47 99.71,101.47 95.65,105.54 22.75,105.54 16.27,99.06 FC1.P$2
A1
  Bottom 0.127: 87.01,30.48 87.01,29.21 86.63,28.83 R13.2 | 84.09,30.48 87.01,30.48 | 87.01,30.48 C10.1 | 84.09,30.48 84.09,32.64 82.31,34.42 82.31,37.08 86,40.77 94.89,40.77 96.28,42.16 96.28,42.93 96.54,43.18 142.13,43.18 T4.1.15/A1 | 84.09,30.48 IC2.1
A2  (via drill 0.3)
  Top 0.127: v77.49,38.48 78.5,38.48 89.42,49.4 v115.59,49.4
  Bottom 0.127: 75.33,37.34 73.93,37.34 C12.1 | 76.47,38.48 75.33,37.34 | IC2.8 76.47,36.2 75.33,37.34 | v77.49,38.48 76.47,38.48 | v115.59,49.4 145.81,49.4 T4.1.16/A2 | 76.47,38.48 R14.2
A3  (via drill 0.3)
  Top 0.127: v76.47,28.96 v76.47,26.92
  Bottom 0.127: C13.1 73.93,31.24 73.17,32 73.17,33.27 73.3,33.4 74.56,33.4 75.96,32 | 75.96,32 76.47,31.5 IC2.7 v76.47,28.96 | v76.47,26.92 77.61,25.78 R20.2 | T4.1.17/A3 102.25,52.07 100.09,54.23 95.52,54.23 84.72,43.43 84.72,42.42 79.26,36.96 78.63,36.96 78.25,36.58 78.25,34.29 75.96,32
A4
  Top 0.127: T4.1.18/A4/SDA 145.94,55.5 147.08,56.64 147.08,62.74 146.19,63.63 143.15,63.63 130.44,76.33 124.35,76.33 108.6,92.08 106.06,92.08 98.69,99.44 98.69,100.08 98.57,100.2 42.31,100.2 22.11,80.01 FF1.P$2
A5
  Top 0.127: T4.1.19/A5/SCL 145.94,58.04 141.62,62.36 141.62,63.75 140.6,64.77 125.62,64.77 118.38,72.01 66.82,72.01 59.96,78.87 37.73,78.87 36.59,80.01 FF2.P$2
A6
  Top 0.127: T4.1.20/A6 145.94,60.45 134.13,72.26 66.94,72.26 59.2,80.01 FF3.P$2
A7
  Bottom 0.127: T4.1.21/A7 128.16,62.23 119.4,70.99 118.13,70.99 110.25,78.87 78.38,78.87 77.23,80.01 FF4.P$2
A8
  Top 0.127: T4.1.22/A8 145.94,64.26 147.34,62.87 147.34,54.36 146.45,53.47 141.37,53.47 138.57,56.26 137.3,56.26 133.75,59.82 113.81,59.82 109.74,63.88 100.09,63.88 98.44,62.23 75.83,62.23 74.69,63.37 47.77,63.37 25.67,41.27 25.67,24.13 15,13.46 15,8.76 16.14,7.62 ENV1.P$2
A9  (via drill 0.3)
  Top 0.127: v20.84,51.05 v17.16,51.05 | v118.25,71.5 60.98,71.5 v53.36,63.88
  Bottom 0.127: 21.86,51.56 24.78,51.56 36.97,39.37 IC4.14 | v17.16,51.05 17.16,52.07 | v20.84,51.05 21.35,51.05 21.86,51.56 | 21.86,51.56 C18.1 | T4.1.23/A9 123.46,67.31 119.27,71.5 v118.25,71.5 | v53.36,63.88 50.31,60.83 50.31,58.93 44.47,53.09 18.18,53.09 17.16,52.07 | 17.16,52.07 R40.2
A10  (via drill 0.3)
  Top 0.127: T4.1.24 159.91,36.83 v157.88,34.8 | v124.6,24.89 123.08,26.42 114.95,26.42 107.46,18.92 93.49,18.92 88.79,14.22 53.99,14.22 47.26,20.95 47.26,22.86 39.13,30.99 v37.86,30.99
  Bottom 0.127: C17.1 29.48,32.26 33.29,32.26 R36.2 33.29,32.13 33.67,31.75 IC4.8 37.1,31.75 v37.86,30.99 | v157.88,34.8 153.43,30.35 153.05,30.35 152.16,29.46 152.16,20.32 144.92,13.08 144.92,12.06 144.41,11.56 134.25,11.56 130.95,14.86 130.95,18.54 v124.6,24.89
A11  (via drill 0.3)
  Top 0.127: v156.73,34.29 T4.1.25 | v148.61,34.29 147.59,34.29 146.19,35.69 140.48,35.69 138.95,37.21 136.16,37.21 130.19,43.18 128.16,43.18 118.13,53.21 72.28,53.21 65.67,59.82 49.29,59.82 45.1,55.63 v45.1,43.05
  Bottom 0.127: C15.1 37.48,43.18 R32.2 37.61,43.18 37.61,41.02 41.04,37.59 43.45,37.59 43.58,37.72 43.58,38.48 42.69,39.37 42.43,39.37 | 42.43,39.37 IC4.1 42.31,39.37 | v148.61,34.29 v156.73,34.29 | v45.1,43.05 44.09,42.04 42.69,42.04 42.43,41.78 42.43,39.37
A12  (via drill 0.3)
  Top 0.127: v43.7,31.75 43.7,35.81 v57.8,49.91 | T4.1.26 161.18,32.64 162.32,33.78 162.32,39.88 161.43,40.77 147.08,40.77 v146.83,41.02 | v91.84,49.91 64.28,49.91 v63.9,50.29
  Bottom 0.127: v43.7,31.75 IC4.7 | v57.8,49.91 57.8,52.07 R27.2 57.93,52.07 58.69,52.83 60.21,52.83 60.34,52.7 60.34,52.58 C1.1 62.5,50.29 v63.9,50.29 | v146.83,41.02 147.08,41.27 147.08,47.5 146.19,48.39 93.36,48.39 v91.84,49.91
A13  (via drill 0.3)
  Top 0.127: v135.53,8.89 132.35,8.89 126.51,3.05 110.76,3.05 109.87,3.94 72.28,3.94 69.74,6.48 37.73,6.48 36.59,7.62 ENV2.P$2
  Bottom 0.127: T4.1.27 161.18,28.32 163.21,26.29 163.21,25.27 164.1,24.38 164.74,24.38 165.5,23.62 165.5,22.86 162.83,20.19 157.5,20.19 146.19,8.89 v135.53,8.89
A14
  Top 0.127: T4.1.38 132.86,29.21 125.36,21.72 112.79,21.72 100.73,9.65 78.88,9.65 77.99,8.76 58.05,8.76 56.91,7.62 ENV3.P$2
A15
  Bottom 0.127: T4.1.39 134.25,31.75 131.33,28.83 126.76,28.83 123.97,31.62 111.14,31.62 106.06,26.54 92.73,26.54 83.84,17.65 83.84,12.19 79.26,7.62 ENV4.P$2
A16  (via drill 0.3)
  Top 0.127: T4.1.40 141.49,34.29 138.83,36.96 133.87,36.96 130.06,40.77 124.86,40.77 v112.92,52.7 | v112.92,75.56 112.92,83.69 97.55,99.06 FEEDBACK.P$2
  Bottom 0.127: v112.92,75.56 v112.92,52.7
A17
  Bottom 0.127: 86.63,33.91 C9.2 | 86.63,33.91 85.74,33.91 84.09,35.56 IC2.14 | 86.63,33.91 R24.2 | T4.1.41 127.02,36.83 124.22,34.04 89.3,34.04 C9.2 | C9.2
D0  (via drill 0.3)
  Top 0.127: v142,28.7 132.73,28.7 123.46,19.43 QUANTISE.1
  Bottom 0.127: T4.1.0/RX 157.37,72.39 147.34,62.36 147.34,32.38 147.08,32.13 147.08,31.24 146.19,30.35 143.65,30.35 v142,28.7
D1
  Bottom 0.127: T1.3 102.38,17.78 115.97,31.37 123.84,31.37 130.32,24.89 132.1,24.89 132.48,24.51 132.48,23.5 132.99,22.99 146.45,22.99 147.34,23.88 147.34,32 147.84,32.51 147.84,53.85 156.73,62.74 156.73,68.71 157.88,69.85 T4.1.1/TX
D2
  Bottom 0.127: T4.1.2 157.88,67.31 156.99,66.42 156.99,54.99 159.78,52.2 159.78,34.04 160.93,32.89 161.69,32.89 163.21,31.37 163.21,27.81 164.1,26.92 164.74,26.92 170.07,21.59 170.07,16.76 U$2.DIN
D3  (via drill 0.3)
  Top 0.127: T4.1.3 161.18,63.88 162.83,62.23 v162.83,58.8
  Bottom 0.127: v162.83,58.8 162.83,38.35 164.1,37.08 169.94,37.08 176.29,30.73 176.29,20.32 172.74,16.76 U$2.LCK
D4
  Top 0.127: T4.1.4 161.18,61.34 162.32,60.2 162.32,59.18 161.43,58.29 160.67,58.29 158.64,56.26 158.64,50.42 160.93,48.13 161.69,48.13 167.53,42.29 167.53,16.76 U$2.BCK
D5
  Top 0.127: ALGORITHM.10 162.83,67.31 161.43,65.91 160.67,65.91 160.04,65.28 160.04,60.83 T4.1.5
D6
  Top 0.127: T4.1.6 161.81,57.15 163.34,58.67 163.34,64.26 167.4,68.33 167.4,70.87 167.15,71.12 167.15,87.12 ALGORITHM.9
D7
  Top 0.127: T4.1.7 169.31,62.74 169.31,72.64 168.04,73.91 168.04,88.39 ALGORITHM.8
D8
  Top 0.127: T4.1.8 169.56,60.45 169.56,72.77 168.93,73.41 168.93,91.44 ALGORITHM.7
D9
  Top 0.127: T4.1.9 161.18,50.42 173.75,62.99 173.75,90.55 161.56,102.74 124.35,102.74 122.95,101.35 109.36,101.35 FB2/4.1
D10
  Bottom 0.127: T4.1.10/CS 162.32,48.13 162.32,58.93 166,62.61 169.69,62.61 173.75,66.67 173.75,83.95 167.15,90.55 167.15,95.63 ALGORITHM.6
D11
  Top 0.127: T4.1.11/MOSI 156.99,48.64 156.99,80.77 165.75,89.53 165.75,96.52 ALGORITHM.5
D12
  Top 0.127: ALGORITHM.4 162.83,87 156.73,80.9 156.73,46.35 T4.1.12/MISO
D13
  Top 0.127: T4.1.13/SCK 149.88,41.91 155.72,47.75 155.72,85.6 158.51,88.39 158.51,95.63 ALGORITHM.3
D28  (via drill 0.3)
  Top 0.127: v155.21,47.88 155.21,85.47 157.88,88.14 157.88,93.34 157.75,93.47 157.75,94.36 ALGORITHM.2
  Bottom 0.127: v155.21,47.88 155.21,38.1 160.04,33.27 160.04,27.81 T4.1.28
D29
  Top 0.127: ENV_MODE.4 90.06,7.62 91.84,9.4 102.63,9.4 110.38,17.14 139.84,17.14 145.69,22.99 160.04,22.99 T4.1.29
D30  (via drill 0.3)
  Top 0.127: v128.67,15.62 140.86,15.62 145.69,20.45 160.04,20.45 T4.1.30
  Bottom 0.127: ENV_MODE.2 94.76,7.62 95.77,6.6 119.65,6.6 v128.67,15.62
D31
  Bottom 0.127: T4.1.31/A12 170.7,9.53 177.82,9.53 178.96,8.38 RESET.1
D32
  Bottom 0.127: ENV_MODE.3 92.47,7.62 96.28,3.81 119.65,3.81 121.94,1.52 140.6,1.52 146.83,7.75 157.5,7.75 158.38,8.64 158.38,13.72 T4.1.32
D33
  Top 0.127: T4.1.33 159.53,16.51 160.67,17.65 164.1,17.65 164.99,16.76 U$2.SCK
D34  (via drill 0.3)
  Top 0.127: v83.71,43.05 91.58,43.05 103.52,31.11 123.08,31.11 128.03,26.16 v128.03,25.4
  Bottom 0.127: R4.2 77.74,49.02 v83.71,43.05 | v128.03,25.4 128.29,25.4 134.64,19.05 T4.1.34
D35  (via drill 0.3)
  Top 0.127: v64.91,48.01 65.17,48.01 86.12,27.05 v120.67,27.05
  Bottom 0.127: R3.2 57.42,57.78 64.91,50.29 v64.91,48.01 | v120.67,27.05 121.3,26.42 127.65,26.42 132.48,21.59 T4.1.35
D36  (via drill 0.3)
  Top 0.127: v48.91,60.07 93.61,60.07 v99.97,53.72 | v104.79,48.9 107.97,48.9 v128.54,28.32
  Bottom 0.127: v48.91,60.07 37.1,60.07 R2.2 | v104.79,48.9 v99.97,53.72 | v128.54,28.32 141.75,28.32 T4.1.36
D37  (via drill 0.3)
  Top 0.127: v49.16,59.05 49.67,59.56 65.55,59.56 74.69,50.42 v114.57,50.42 | v133.49,50.42 139.08,44.83 141.49,44.83 144.29,42.04 144.29,39.37 145.69,37.97 146.45,37.97 149.11,35.31 149.11,31.5 147.08,29.46 147.08,27.81 T4.1.37
  Bottom 0.127: v49.16,59.05 36.72,59.05 35.7,60.07 16.78,60.07 R1.2 | v133.49,50.42 v114.57,50.42
D+
  Top 0.127: PAD3.1 170.7,69.09 172.61,67.18 USBHOST.3
  Bottom 0.127: T4.1.UD+ 169.05,63.5 172.61,67.06 USBHOST.3
D-
  Bottom 0.127: PAD2.1 172.74,69.09 170.83,67.18 USBHOST.2 170.7,67.06 169.69,66.04 T4.1.UD-
GND  (via drill 0.3)
  Top 0.127: 12.97,20.7 12.97,21.84 LEVEL1.P$E | 12.97,20.7 12.97,8.64 16.14,5.46 16.14,5.21 ENV1.P$1 | 12.97,20.7 9.41,20.7 8.27,21.84 8.02,21.84 LEVEL1.P$1 | v77.11,31.75 v77.11,27.94 77.11,25.15 76.34,24.38 | 76.34,24.38 73.93,21.97 LEVEL4.P$E 73.8,21.97 72.66,23.11 70.37,23.11 69.23,21.97 68.98,21.97 LEVEL4.P$1 68.85,21.97 67.71,23.11 65.29,23.11 64.15,21.97 53.61,21.97 LEVEL3.P$E | 85.49,15.24 88.15,15.24 90.44,17.53 GATE_IN.P$3 | ENV4.P$1 77.23,5.21 82.19,5.21 84.6,7.62 ENV_MODE.6 | 85.49,15.24 76.34,24.38 | 85.49,15.24 IC9.2 | J1.3 J1.4 J1.6 J1.8 | J1.3 J1.5 J1.7 165.5,8.89 166.64,7.75 174.01,7.75 174.51,8.26 RESET.3 174.64,8.38 175.15,8.89 175.15,16.64 U$2.GND | 118.51,11.43 118.51,10.03 IC1.2 | 118.51,11.43 118.89,11.43 120.03,12.57 127.27,12.57 C7.2 | 118.51,11.43 C4.2 118.38,11.43 115.71,14.1 109.49,14.1 OUT.P$3 | J1.3 158.64,8.89 157.5,10.03 144.92,10.03 142.51,7.62 C2.2 | FF1.P$1 16.27,77.6 28.59,77.6 28.72,77.72 36.34,77.72 36.47,77.6 FF2.P$1 | 78.38,87.25 78.38,95.38 77.23,96.52 FC4.P$1 77.11,96.65 76.98,96.77 69.36,96.77 69.23,96.65 56.91,96.65 FC3.P$1 | 78.38,87.25 78.38,78.99 77.23,77.85 77.23,77.6 FF4.P$1 | 106.95,54.48 103.01,58.42 97.55,58.42 ATT2.P$1 | 98.69,77.47 103.01,77.47 106.95,73.53 F2MOD.P$3 | 98.69,77.47 97.55,77.47 ATT1.P$1 | 97.55,87.25 97.55,84.58 98.69,83.44 98.69,77.47 | 97.55,87.25 97.55,96.52 FEEDBACK.P$1 | 97.55,87.25 78.38,87.25 | T4.1.AGND 139.72,72.39 138.7,73.41 L2MOD.P$3 138.7,73.53 134.76,77.47 129.3,77.47 L2ATT.P$1 | 138.7,92.58 134.76,96.52 129.3,96.52 L1ATT.P$1 | 158.26,60.96 158.26,61.98 159.78,63.5 159.78,73.53 T4.1.GND
  Top 0.127: 138.7,92.58 153.94,92.58 154.32,92.96 155.34,92.96 156.86,91.44 ALGORITHM.A | 138.7,92.58 L1MOD.P$3 | U$2.1 164.35,23.24 164.35,25.65 U$2.2 164.23,25.78 164.23,26.8 163.21,27.81 163.21,29.72 164.23,30.73 U$2.4 | U$2.G1 164.23,35.94 163.21,36.96 163.21,38.99 164.23,40.01 164.23,40.89 U$2.G2 164.23,41.02 163.21,42.04 163.21,44.07 161.69,45.59 160.93,45.59 158.38,48.13 158.38,56.39 159.27,57.28 159.27,58.93 158.26,59.94 158.26,60.96 | ATT3.P$1 97.55,39.37 103.01,39.37 106.95,35.43 F4MOD.P$3 | R16.A 135.78,32.38 138.7,35.31 L4MOD.P$3 | R16.A 129.3,36.58 129.3,39.37 L4ATT.P$1 | T4.1.GND2 153.56,31.75 T4.1.GND1 144.54,40.77 144.54,42.8 138.7,48.64 L3MOD.P$3 138.7,54.48 134.76,58.42 129.3,58.42 L3ATT.P$1 129.18,58.42 125.24,54.48 106.95,54.48 | 158.26,60.96 T4.1.GND-U1 | 106.95,54.48 F3MOD.P$3 | QUANTISE.2 127.4,24.13 133.49,30.23 R16.A
  Bottom 0.127: C20.2 44.72,31.75 48.53,27.94 48.53,23.11 | 48.53,23.11 48.53,21.97 LEVEL3.P$1 48.53,21.84 48.15,21.84 47.01,20.7 44.72,20.7 38.37,27.05 | ENV3.P$1 56.78,5.21 56.78,5.46 53.61,8.64 53.61,21.84 LEVEL3.P$E 53.48,21.97 52.34,23.11 48.53,23.11 | 37.1,35.56 37.1,34.29 | 37.1,34.29 38.37,34.29 | 38.37,34.29 40.4,34.29 | 40.4,34.29 IC4.5 | 37.1,34.29 IC4.10 | 37.1,35.56 37.1,36.83 IC4.12 | 37.1,35.56 IC4.11 | IC4.3 40.91,36.83 40.4,36.32 40.4,34.29 | 33.29,20.7 33.29,21.84 LEVEL2.P$E 33.29,21.97 38.37,27.05 | 33.29,20.7 33.29,8.64 36.47,5.46 36.47,5.21 ENV2.P$1 | 33.29,20.7 29.73,20.7 28.59,21.84 28.34,21.84 LEVEL2.P$1 28.21,21.84 27.07,20.7 24.65,20.7 23.51,21.84 12.97,21.84 LEVEL1.P$E | 38.37,27.05 38.37,34.29 | IC2.12 81.55,35.69 80.28,35.69 IC2.11 80.28,31.75 | IC2.3 81.55,30.86 80.66,31.75 80.28,31.75 | 80.28,31.75 79.9,31.75 79.01,30.86 IC2.5 79.01,30.35 78.25,29.59 78.25,27.94 C19.2 v77.11,27.94 | C14.2 80.28,14.73 79.52,15.49 79.52,16.76 81.04,18.29 81.3,18.29 81.42,18.41 81.42,19.68 80.92,20.19 75.58,20.19 73.93,21.84 LEVEL4.P$E | IC2.10 79.01,33.66 v77.11,31.75 | 106.95,16.76 V/OCT_IN.P$3 106.95,17.53 | 106.95,16.76 109.49,14.22 OUT.P$3 | 96.79,18.41 97.42,18.41 T1.1 | T1.1 96.28,10.92 96.28,7.62 ENV_MODE.1 | 106.95,16.76 104.54,16.76 103.01,15.24 T1.1 | IC9.2 84.34,14.22 84.34,12.32 84.6,12.06 84.6,7.62 ENV_MODE.6 | 96.79,18.41 91.2,18.41 90.44,17.65 GATE_IN.P$3 | 96.79,18.41 D2.A | IC1.2 125.49,3.05 131.08,3.05 C6.2 | 129.81,15.24 C5.1 | 129.81,15.24 127.27,12.7 C7.2 | C8.2 134.89,4.57 135.65,5.33 135.65,6.6 | 135.65,6.6 135.65,8.13 134.89,8.89 C3.1 134.89,10.29 130.32,14.86 130.32,15.24 C5.1
  Bottom 0.127: C2.2 142,7.62 140.99,6.6 135.65,6.6 | QUANTISE.2 122.19,22.86 129.81,15.24 | 130.19,15.24 C5.1 | FC2.P$1 36.47,96.52 36.47,94.74 35.32,93.6 35.32,78.74 36.47,77.6 FF2.P$1 36.59,77.6 48.91,77.6 49.04,77.72 56.91,77.72 | FC1.P$3 16.14,101.47 16.14,101.22 15,100.08 15,78.74 16.14,77.6 FF1.P$1 | 56.91,77.72 56.91,77.85 58.05,78.99 58.05,95.38 56.91,96.52 FC3.P$1 | 56.91,77.72 56.91,77.6 FF3.P$1 56.91,77.72 | FB2/4.2 104.54,96.65 97.55,96.65 FEEDBACK.P$1 | F3MOD.P$3 106.95,55.75 108.22,57.02 108.22,72.14 106.95,73.41 F2MOD.P$3 | 156.86,79.25 156.86,91.44 ALGORITHM.A | 156.86,79.25 T4.1.GND 163.72,74.93 166.39,72.26 PAD4.1 | T4.1.AGND 150,72.39 156.86,79.25 | T4.1.GND2 154.45,29.21 158.38,25.27 162.19,25.27 164.23,23.24 U$2.1 | C16.2 179.34,60.58 178.32,60.58 177.31,61.59 IC3.5 176.42,61.59 | 176.42,61.59 175.15,60.33 IC3.3 171.59,60.33 171.47,60.2 169.18,60.2 C28.1 169.18,60.07 166,60.07 163.21,57.28 163.21,42.04 164.23,41.02 U$2.G2 | 176.42,61.59 175.28,62.74 175.28,67.06 USBHOST.4 | 165.5,31.24 164.74,31.24 164.35,30.86 U$2.4 | 165.5,31.24 170.45,31.24 R8.1 | 165.5,31.24 165.5,33.78 164.35,34.92 164.35,35.81 U$2.G1 | T4.1.GND1 145.94,38.48 147.08,37.34 147.08,36.32 146.19,35.43 138.7,35.43 L4MOD.P$3 | F4MOD.P$3 106.95,35.43 125.24,35.43 129.18,39.37 L4ATT.P$1
  pour Bottom: 0.27,105.41 180.61,105.41 180.61,0 0.27,0 0.27,2.54
N$1
  Bottom 0.127: R62.2 168.8,53.34 169.18,53.72 C11.2 169.18,56.39 170.58,57.78 IC3.1
N$2
  Bottom 0.127: R3.1 57.42,61.85 53.61,61.85 LEVEL3.P$B
N$3
  Bottom 0.127: 39.26,46.99 40.91,48.64 R33.1 | 39.26,46.99 39.26,45.72 | 39.26,45.72 39.26,43.18 | 39.26,46.99 C15.2 | 39.26,45.72 42.56,45.72 | R35.2 43.45,44.83 42.56,45.72 | 42.56,45.72 R34.2 | IC4.2 41.8,38.1 39.26,40.64 39.26,43.18 | 39.26,43.18 R32.1
N$4
  Top 0.127: J1.1 J1.2
  Bottom 0.127: J1.1 155.72,10.16 148.86,10.16 D1.C
N$5
  Bottom 0.127: R25.1 104.92,33.02 104.92,31.24 106.95,29.21 V/OCT_IN.P$1
N$6
  Bottom 0.127: D3.A 155.34,6.35 156.48,7.49 166,7.49 | J1.10 166,7.49 | J1.9 167.15,8.64 166,7.49
N$7
  Bottom 0.127: R9.2 146.45,3.68 D3.C
N$8
  Bottom 0.127: R35.1 43.45,40.26 44.09,39.62 44.09,37.21 43.96,37.08 43.96,32.13 45.99,30.1 45.99,21.97 LEVEL3.P$2
N$9
  Bottom 0.127: R7.2 148.86,12.7 D1.A
N$10
  Bottom 0.127: R4.1 77.74,61.85 73.93,61.85 LEVEL4.P$B
N$11
  Bottom 0.127: R10.2 167.02,49.53 167.02,46.23 164.35,43.56 U$2.L
N$12
  Bottom 0.127: R6.1 175.53,29.97 175.28,29.72 170.45,29.72 R8.2 170.45,29.59 165.62,29.59 164.35,28.32 U$2.3
N$13
  Bottom 0.127: R53.2 173.75,53.34 173.75,47.88 164.35,38.48 U$2.R
N$14
  Bottom 0.127: ATT2.P$3 97.55,63.5 104.54,63.5 106.95,65.91 F3MOD.P$1
N$15  (via drill 0.3)
  Top 0.127: v80.53,28.96 59.58,49.91 58.94,49.91 v49.8,59.05
  Bottom 0.127: v80.53,28.96 81.93,27.56 81.93,26.67 R26.1 | v49.8,59.05 49.8,62.87 36.34,76.33 35.45,76.33 35.07,76.71 35.07,97.66 36.47,99.06 FC2.P$2
N$16  (via drill 0.3)
  Top 0.127: v83.45,31.75 v83.45,42.16
  Bottom 0.127: R12.1 82.82,25.91 83.58,26.67 | C10.2 88.66,30.48 88.66,29.21 86.63,27.18 R13.1 86.63,27.05 86.25,26.67 R26.2 83.58,26.67 | R11.2 94.25,63.25 84.22,53.21 84.22,42.93 v83.45,42.16 | v83.45,31.75 83.45,31.11 82.82,30.48 IC2.2 82.82,30.35 83.58,29.59 83.58,26.67
N$17
  Bottom 0.127: 76.47,40.13 75.33,38.99 C12.2 73.93,38.86 72.91,37.85 72.91,26.67 76.85,22.73 78.5,22.73 79.39,23.62 80.28,23.62 R15.1 | 78.25,38.61 77.99,38.61 76.47,40.13 | 78.25,38.61 79.01,38.61 | 76.47,40.13 R14.1 | R19.2 94.25,53.34 84.47,43.56 84.47,42.55 80.53,38.61 79.01,38.61 | 79.01,38.61 R18.2 | IC2.9 77.74,38.1 78.25,38.61
N$18
  Bottom 0.127: R11.1 94.25,79.63 97.04,79.63 97.42,80.01 ATT1.P$2
N$19
  Bottom 0.127: 77.74,24.26 R21.1 | 77.74,24.26 79.26,25.78 R20.1 | C13.2 73.93,32.26 75.2,30.99 75.2,28.45 | 75.2,28.45 R17.2 75.2,27.43 75.96,26.67 75.96,26.04 77.74,24.26 | R22.2 94.25,41.4 84.34,41.4 79.52,36.58 79.52,32.64 77.74,30.86 IC2.6 77.74,29.59 76.6,28.45 75.2,28.45
N$20
  Bottom 0.127: R19.1 94.25,60.58 97.04,60.58 97.42,60.96 ATT2.P$2
N$21
  Bottom 0.127: 86.63,32.26 89.17,32.26 | 89.17,32.26 90.69,33.78 105.43,33.78 106.19,33.02 R25.2 122.95,33.02 126.13,29.84 R16.S | 89.17,32.26 C9.1 | IC2.13 82.82,35.18 85.74,32.26 86.63,32.26 | 86.63,32.26 R24.1
N$22
  Bottom 0.127: R17.1 75.2,24.89 77.11,22.99 78.38,22.99 79.52,24.13 79.52,24.38 79.64,24.51 80.92,24.51 81.55,23.88 81.55,21.08 81.17,20.7 77.61,20.7 75.33,22.99 75.33,23.88 65.42,33.78 65.42,60.58 59.71,66.29 59.71,81.41 77.11,98.81 77.11,99.06 FC4.P$2
N$23
  Bottom 0.127: ATT3.P$3 97.55,44.45 104.54,44.45 106.95,46.86 F4MOD.P$1
N$24  (via drill 0.3)
  Top 0.127: v61.74,82.8 61.74,89.41 55.64,95.5 55.64,97.92 56.78,99.06 FC3.P$2
  Bottom 0.127: R18.1 79.01,47.37 59.96,66.42 59.96,81.03 v61.74,82.8
N$25
  Bottom 0.127: R16.E 133.24,27.05 133.24,24.13 R23.1
N$26
  Bottom 0.127: IC3.7 176.93,59.05 176.93,60.33 IC3.6
N$27
  Bottom 0.127: ATT3.P$2 97.3,41.91 95.27,39.88 94.25,39.88 R22.1
N$28
  Bottom 0.127: ATT1.P$3 97.55,82.55 104.54,82.55 106.95,84.96 F2MOD.P$1
N$29
  Bottom 0.127: R28.2 96.79,27.56 91.96,27.56 90.44,29.08 GATE_IN.P$1
N$30
  Bottom 0.127: R28.1 D2.C 96.79,20.19 100.47,16.51 T1.2
N$31
  Bottom 0.127: 59.96,48.64 62.5,48.64 C1.2 | 59.96,48.64 59.58,48.26 R29.1 | 59.96,48.64 59.58,49.02 59.58,52.07 R27.1 | 59.96,48.64 R29.1 | 57.93,41.78 57.93,44.2 58.18,44.45 R30.2 58.31,44.45 59.45,45.59 59.45,48.26 R29.1 | 57.93,41.78 57.93,39.37 R31.2 | IC4.6 42.69,33.02 43.7,34.04 43.7,37.47 43.83,37.59 43.83,39.5 43.07,40.26 42.81,40.26 42.69,40.39 42.69,41.66 42.81,41.78 57.93,41.78
N$32
  Bottom 0.127: R31.1 59.58,39.37 59.58,28.7 66.31,21.97 LEVEL4.P$2
N$33
  Bottom 0.127: L4ATT.P$3 129.3,44.45 136.29,44.45 138.7,46.86 L4MOD.P$1
N$34  (via drill 0.3)
  Top 0.127: v59.07,50.42 63.14,50.42 76.47,37.08 v82.95,37.08
  Bottom 0.127: v59.07,50.42 58.82,50.16 58.82,47.88 56.66,45.72 56.66,44.45 R30.1 | v82.95,37.08 87.14,37.08 89.68,39.62 92.98,39.62 93.61,38.99 94.89,38.99 96.28,40.39 96.28,40.51 96.54,40.77 128.03,40.77 129.18,41.91 L4ATT.P$2
N$36
  Bottom 0.127: L3ATT.P$3 129.3,63.5 136.29,63.5 138.7,65.91 L3MOD.P$1
N$37  (via drill 0.3)
  Top 0.127: v61.48,63.88 89.04,63.88 89.68,63.25 95.01,63.25 96.41,64.64 120.03,64.64 123.71,60.96 L3ATT.P$2
  Bottom 0.127: v61.48,63.88 58.69,61.09 57.04,61.09 44.34,48.39 44.34,45.72 R34.1
N$39
  Bottom 0.127: R2.1 37.1,61.85 33.29,61.85 LEVEL2.P$B
N$40
  Bottom 0.127: R39.2 21.86,25.65 19.83,27.69 19.83,29.21 20.59,29.97 R38.2 R37.1 20.59,33.53 29.23,33.53 29.48,33.78 C17.2 33.29,33.91 R36.1 33.29,33.78 34.05,33.02 IC4.9
N$41
  Bottom 0.127: R39.1 21.86,23.24 24.4,23.24 25.67,21.97 LEVEL2.P$2
N$42
  Bottom 0.127: L2ATT.P$3 129.3,82.55 136.29,82.55 138.7,84.96 L2MOD.P$1
N$43  (via drill 0.3)
  Top 0.127: v25.16,33.02 25.16,41.15 v61.1,77.09
  Bottom 0.127: v25.16,33.02 20.59,28.45 R38.1 | v61.1,77.09 68.72,77.09 72.79,81.15 128.03,81.15 129.18,80.01 L2ATT.P$2
N$45
  Bottom 0.127: R1.1 16.78,61.85 12.97,61.85 LEVEL1.P$B
N$46
  Bottom 0.127: 20.59,49.91 C18.2 | 18.94,48.26 20.59,49.91 | 20.59,49.91 18.94,51.56 18.94,52.07 R40.1 | 18.94,44.45 19.7,43.69 21.86,43.69 R42.2 21.86,43.56 27.32,38.1 IC4.13 | 18.94,44.45 18.94,48.26 | 18.94,48.26 R41.1 | 18.94,44.45 R43.2
N$47
  Bottom 0.127: R43.1 17.16,44.45 17.16,33.66 5.48,21.97 LEVEL1.P$2
N$48
  Bottom 0.127: L1ATT.P$3 129.3,101.6 136.29,101.6 138.7,104.01 L1MOD.P$1
N$49  (via drill 0.3)
  Top 0.127: v60.47,77.6 v28.21,45.34
  Bottom 0.127: v28.21,45.34 21.86,45.34 R42.1 | v60.47,77.6 74.95,92.08 116.73,92.08 123.71,99.06 L1ATT.P$2
N$53
  Bottom 0.127: R10.1 168.8,49.53 168.8,50.04 172.1,53.34 R53.1 172.23,53.34 172.23,56.64 172.99,57.4 172.99,58.17 172.1,59.05 IC3.2 171.21,59.05 170.2,58.04 169.18,58.04 | 169.18,58.04 165.37,58.04 R55.2 | 169.18,58.04 C11.1
N$55
  Bottom 0.127: R55.1 165.37,56.26 167.02,54.61 167.02,53.34 R62.1 167.15,53.34 167.15,50.8 168.04,49.91 168.04,48.9 168.16,48.77 169.43,48.77 173.12,52.45 173.12,53.98 173.24,54.1 174.51,54.1 180.23,48.39 180.23,7.87 175.4,3.05 149.5,3.05 147.72,1.27 110.76,1.27 109.49,2.54 OUT.P$1
VCC  (via drill 0.3)
  Top 0.127: ENV1.P$3 16.27,10.03 28.59,10.03 28.72,9.91 36.34,9.91 36.47,10.03 ENV2.P$3 36.59,10.03 48.91,10.03 49.04,9.91 56.66,9.91 56.78,10.03 ENV3.P$3 56.91,10.03 57.04,9.91 70.88,9.91 71.01,10.03 77.11,10.03 ENV4.P$3 | v40.91,36.2 43.45,36.2 v44.59,37.34 44.59,57.91 48.53,61.85 LEVEL3.P$3 48.66,61.98 49.8,63.12 54.63,63.12 55.77,61.98 68.85,61.98 LEVEL4.P$3 | 15,63.12 27.07,63.12 28.21,61.98 LEVEL2.P$3 | 15,63.12 11.95,63.12 10.81,61.98 8.02,61.98 LEVEL1.P$3 | 15,63.12 15,81.03 16.14,82.17 16.14,82.42 FF1.P$3 16.14,82.55 16.14,96.52 FC1.P$1 16.27,96.65 28.59,96.65 33.42,101.47 36.47,101.47 FC2.P$3 | T4.1.V33 156.1,34.29 T4.1.3V3 | v160.8,55.88 161.56,55.88 168.16,62.48 168.16,67.06 USBHOST.1 | FEEDBACK.P$3 97.42,101.47 97.3,101.35 89.68,101.35 89.55,101.47 77.23,101.47 FC4.P$3 77.11,101.47 71.01,101.47 70.88,101.35 57.04,101.35 56.91,101.47 FC3.P$3 | FF4.P$3 77.11,82.42 71.01,82.42 70.88,82.3 57.04,82.3 56.91,82.42 FF3.P$3
  Bottom 0.127: C19.1 79.9,29.97 80.28,30.35 IC2.4 | C19.1 79.9,26.67 82.06,24.51 82.06,23.11 82.44,22.73 83.45,22.73 83.58,22.61 83.58,12.32 79.9,8.64 78.63,8.64 77.23,10.03 ENV4.P$3 | C19.1 | ENV3.P$3 56.78,10.16 56.78,24 44.72,36.07 C20.1 44.59,36.58 v44.59,37.34 | IC4.4 41.55,35.56 v40.91,36.2 | LEVEL3.P$3 48.53,61.98 38.37,61.98 37.23,63.12 29.48,63.12 28.34,61.98 LEVEL2.P$3 | USBHOST.1 168.16,67.18 168.16,70.1 164.74,73.53 151.53,73.53 147.84,69.85 T4.1.3V3_LO 145.94,70.74 139.97,76.71 139.97,89.53 130.44,99.06 130.44,100.08 130.19,100.33 108.86,100.33 107.71,101.47 97.55,101.47 FEEDBACK.P$3 | T4.1.3V3 161.18,40.26 160.04,41.4 160.04,55.12 v160.8,55.88 | 37.73,98.04 37.73,100.33 36.59,101.47 FC2.P$3 | 37.73,98.04 37.73,95.63 36.59,94.49 36.59,82.55 FF2.P$3 | 55.64,98.04 55.64,100.33 56.78,101.47 FC3.P$3 | 55.64,98.04 55.64,95.5 56.78,94.36 56.78,82.55 FF3.P$3 | 55.64,98.04 37.73,98.04

### Text on the board
tNames: USB / (NO 5V)
bNames: USB HOST